# EAGLE board backplane (EAGLE 9.6.2), part 1 of 2
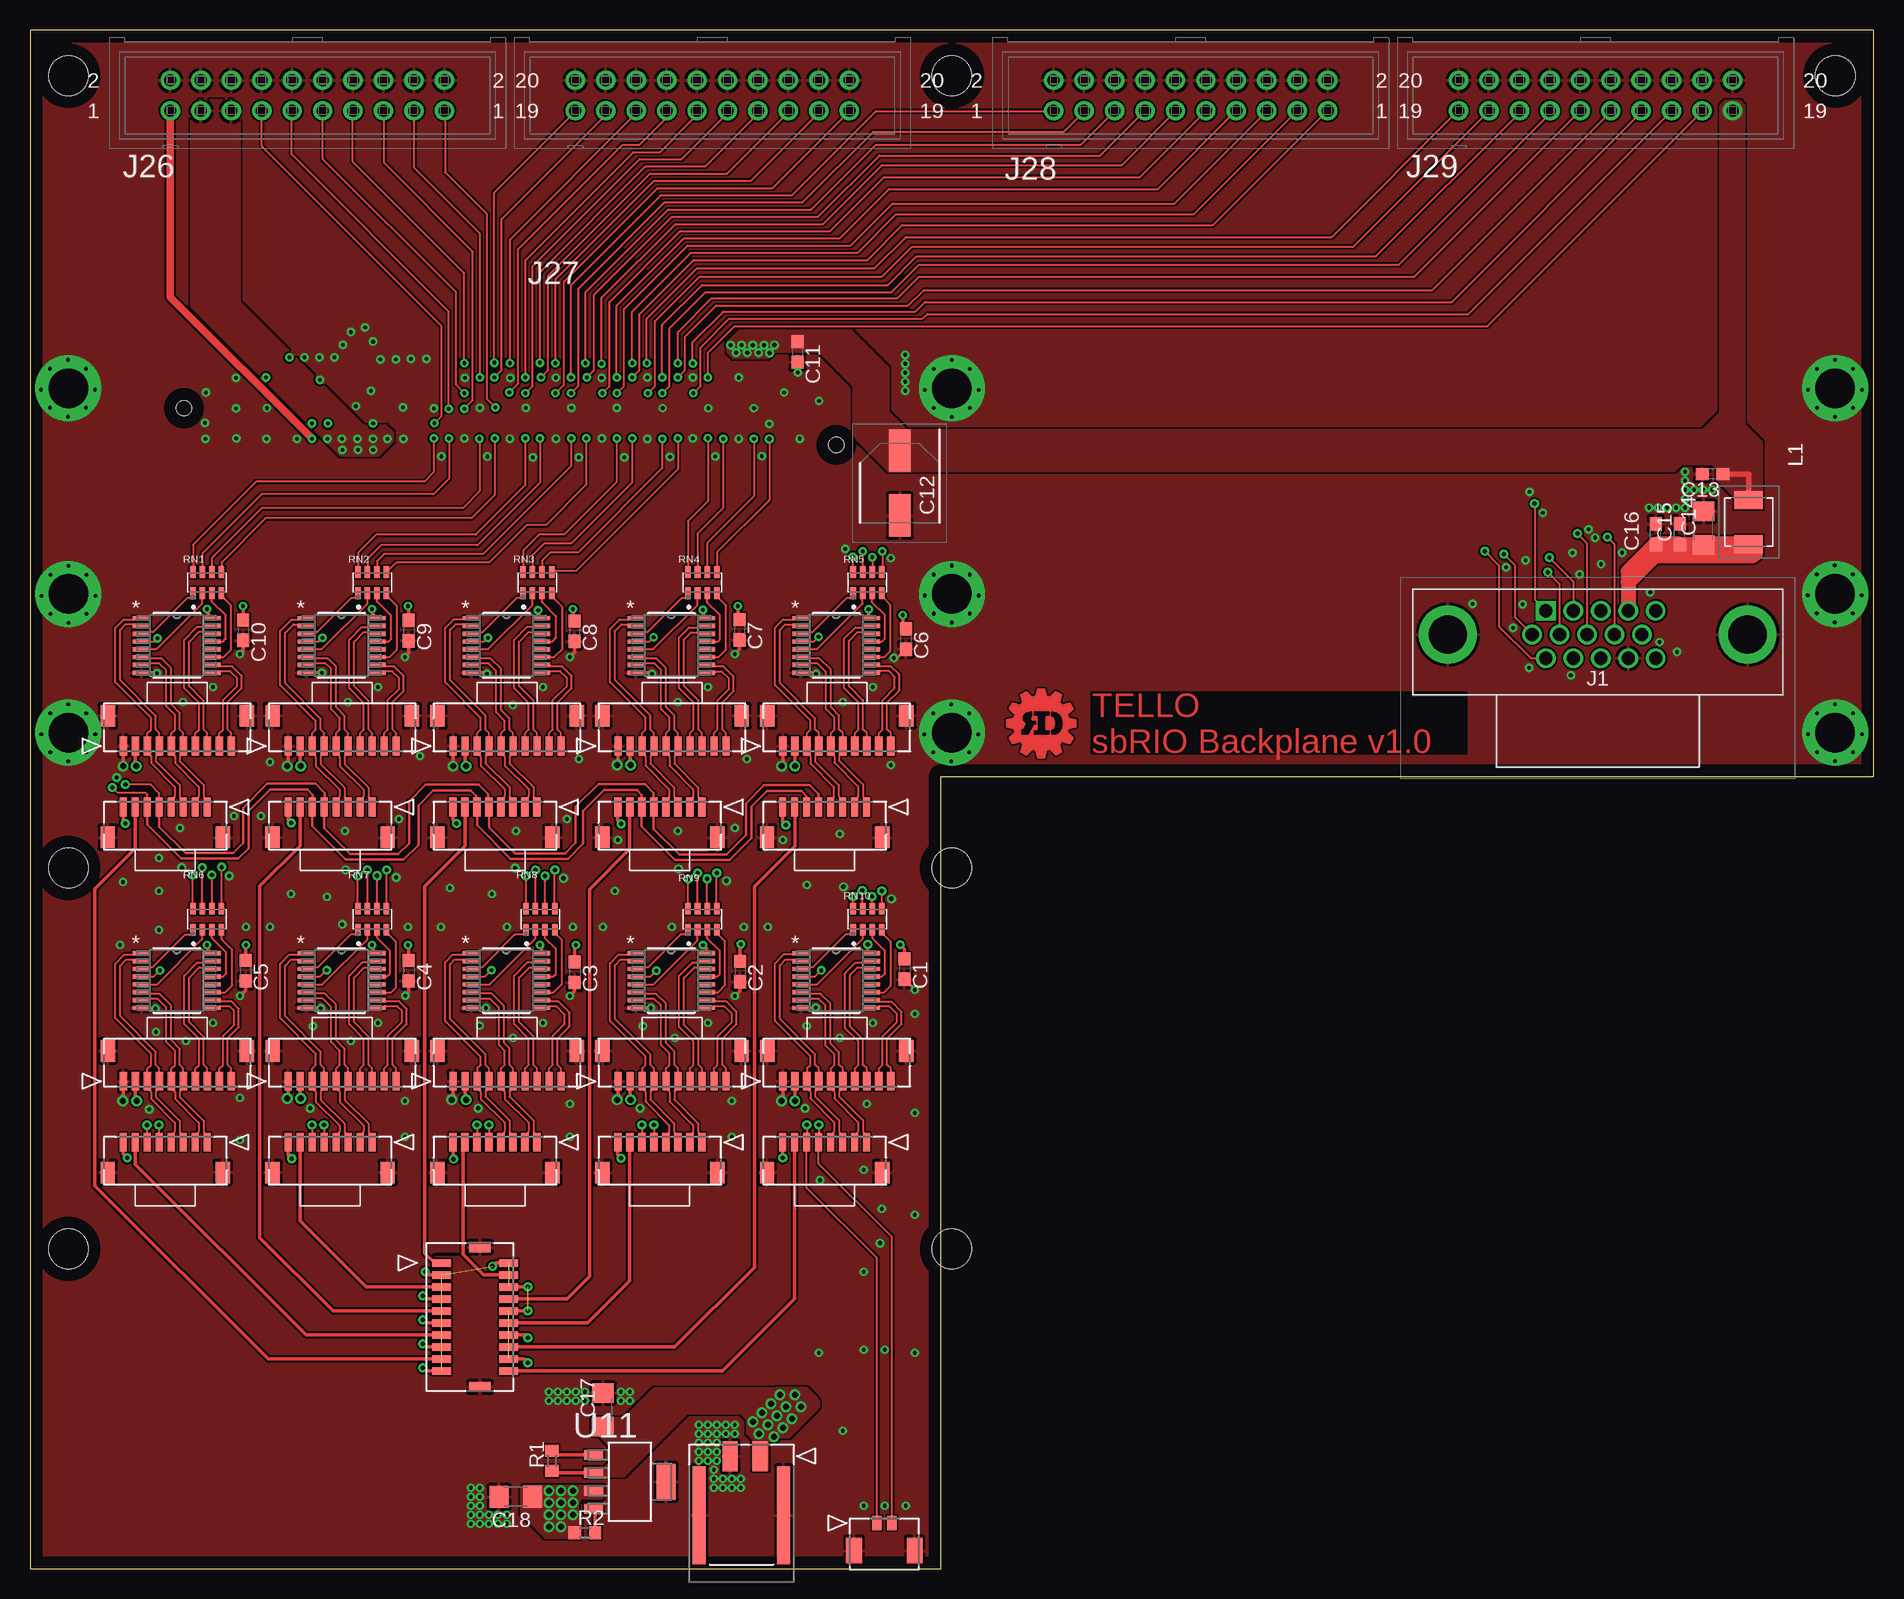
[diagram p5: board, top side]
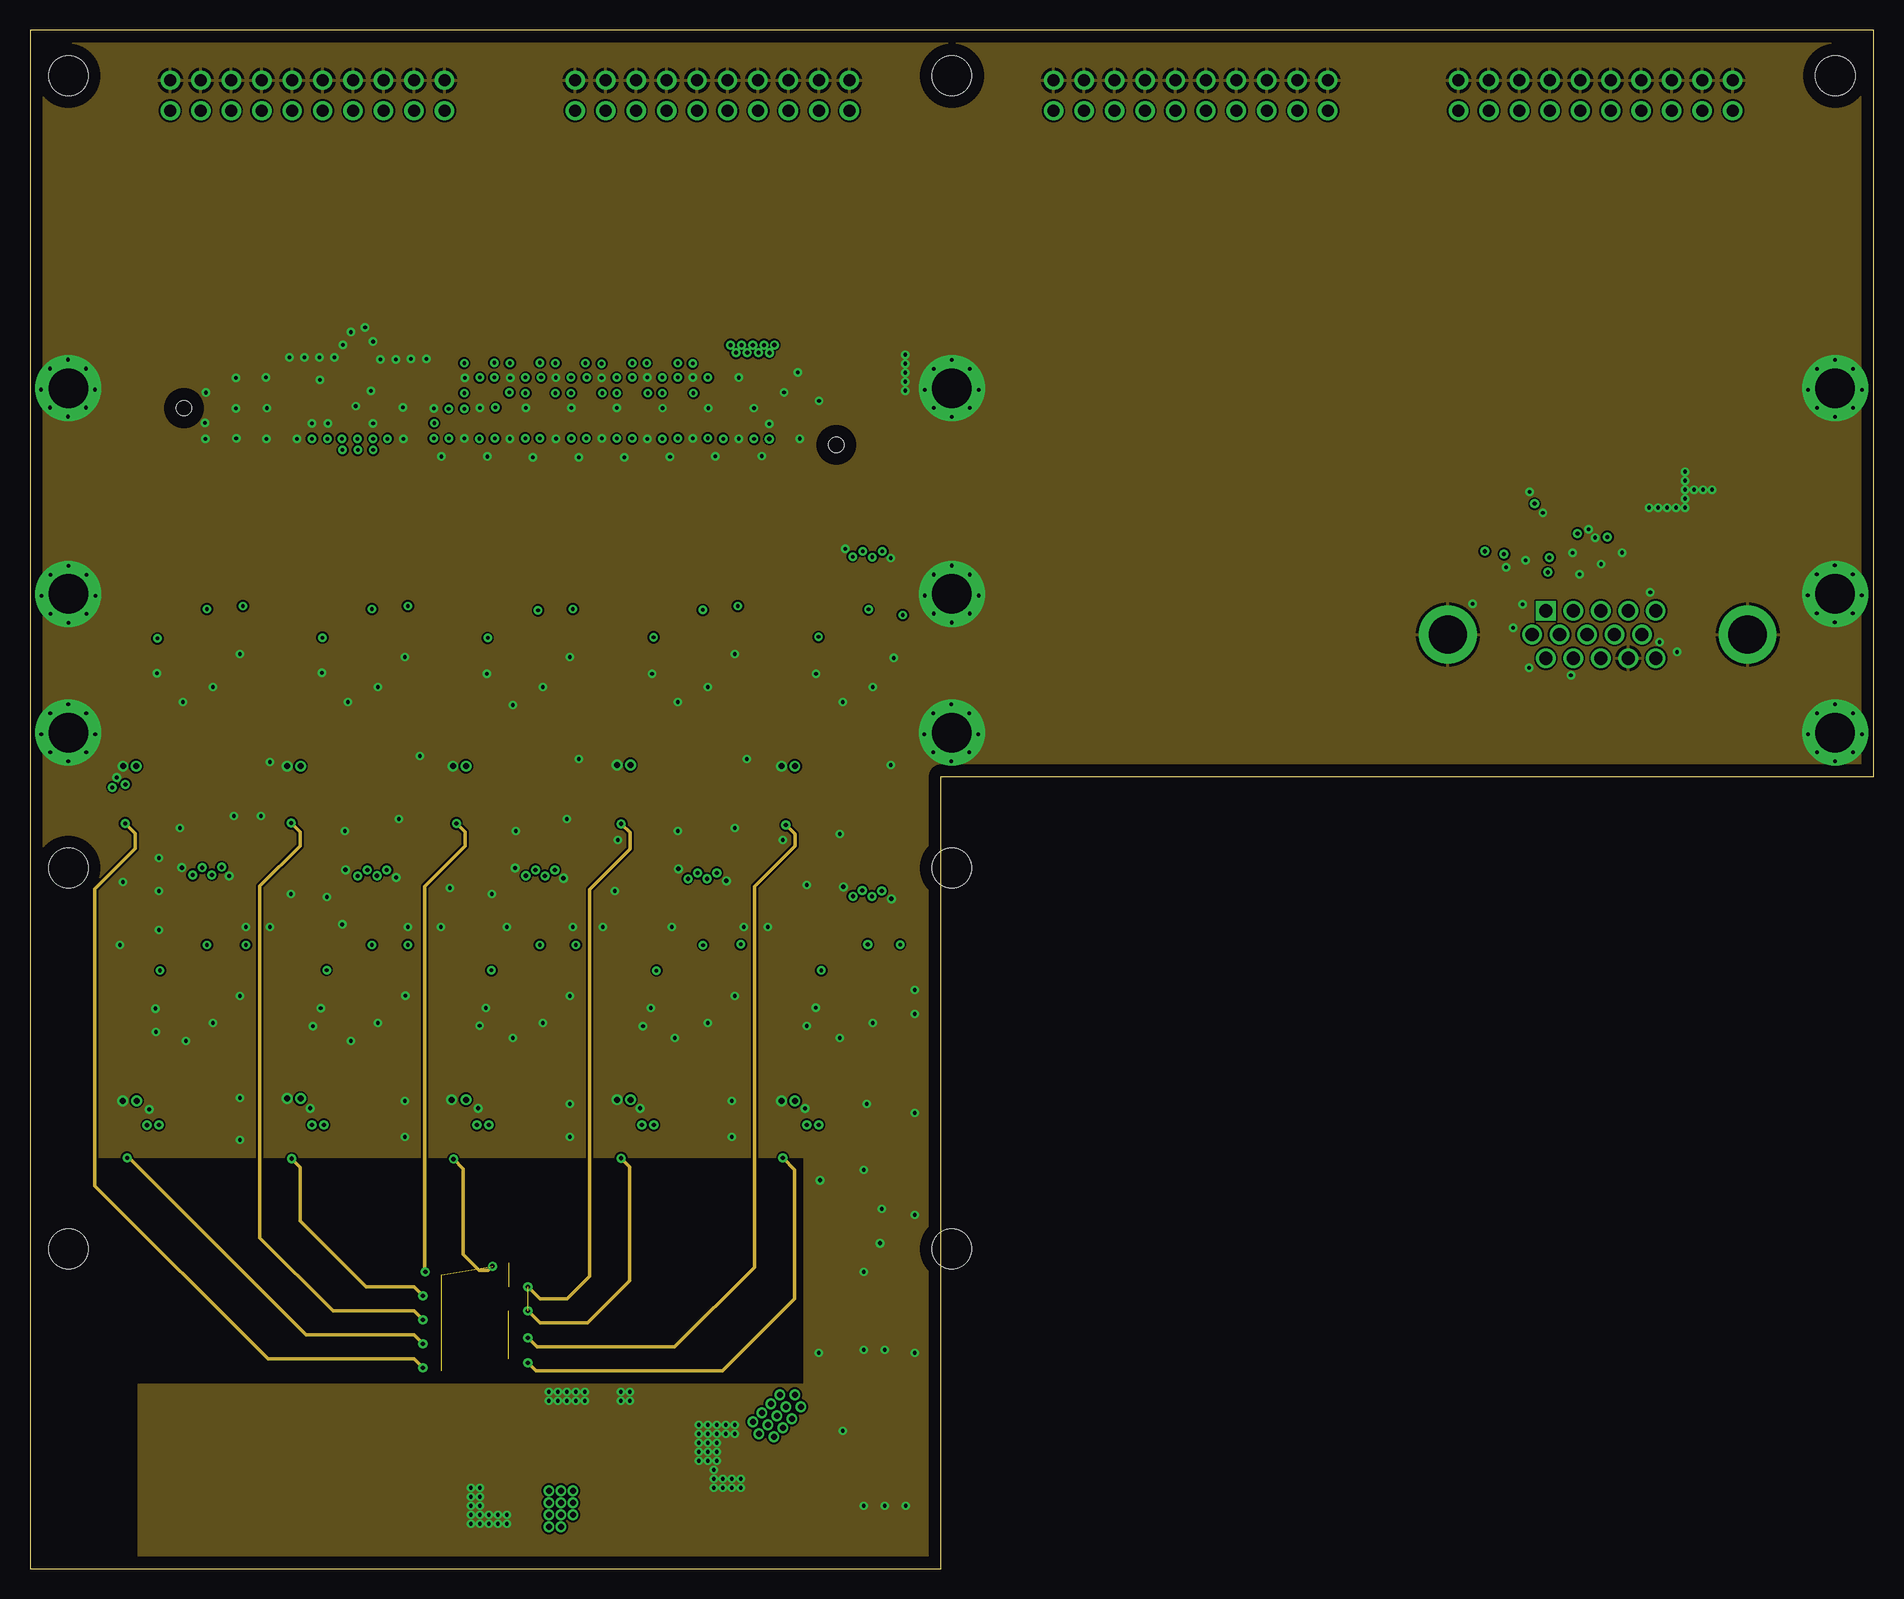
[diagram p6: board, inner layer Route2]
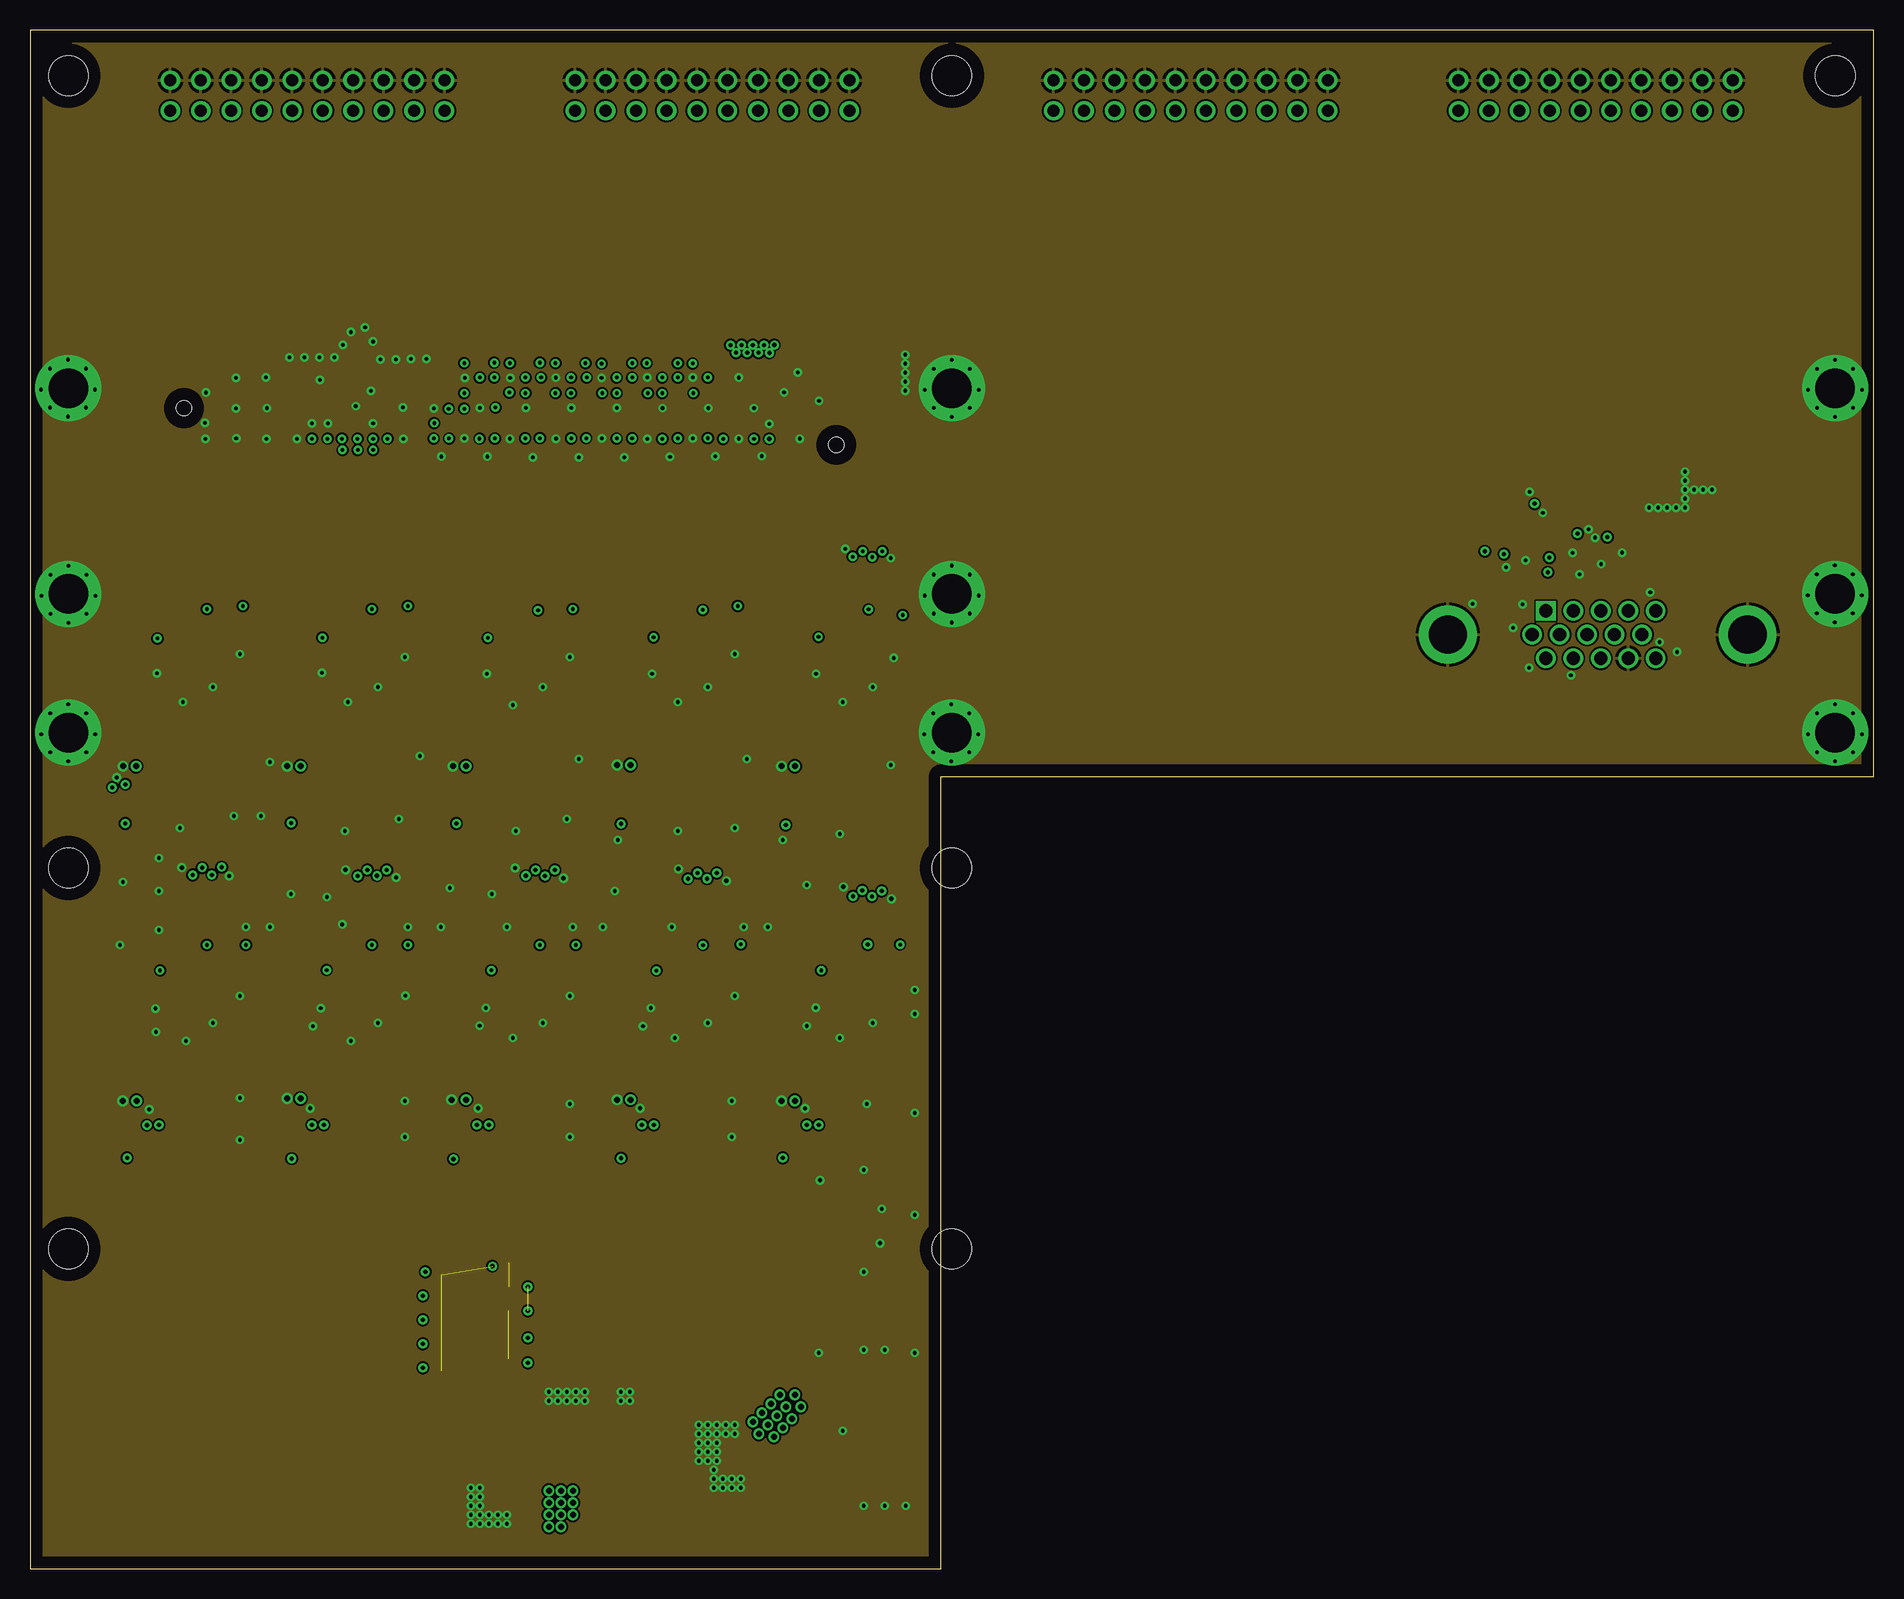
[diagram p7: board, inner layer Route15]
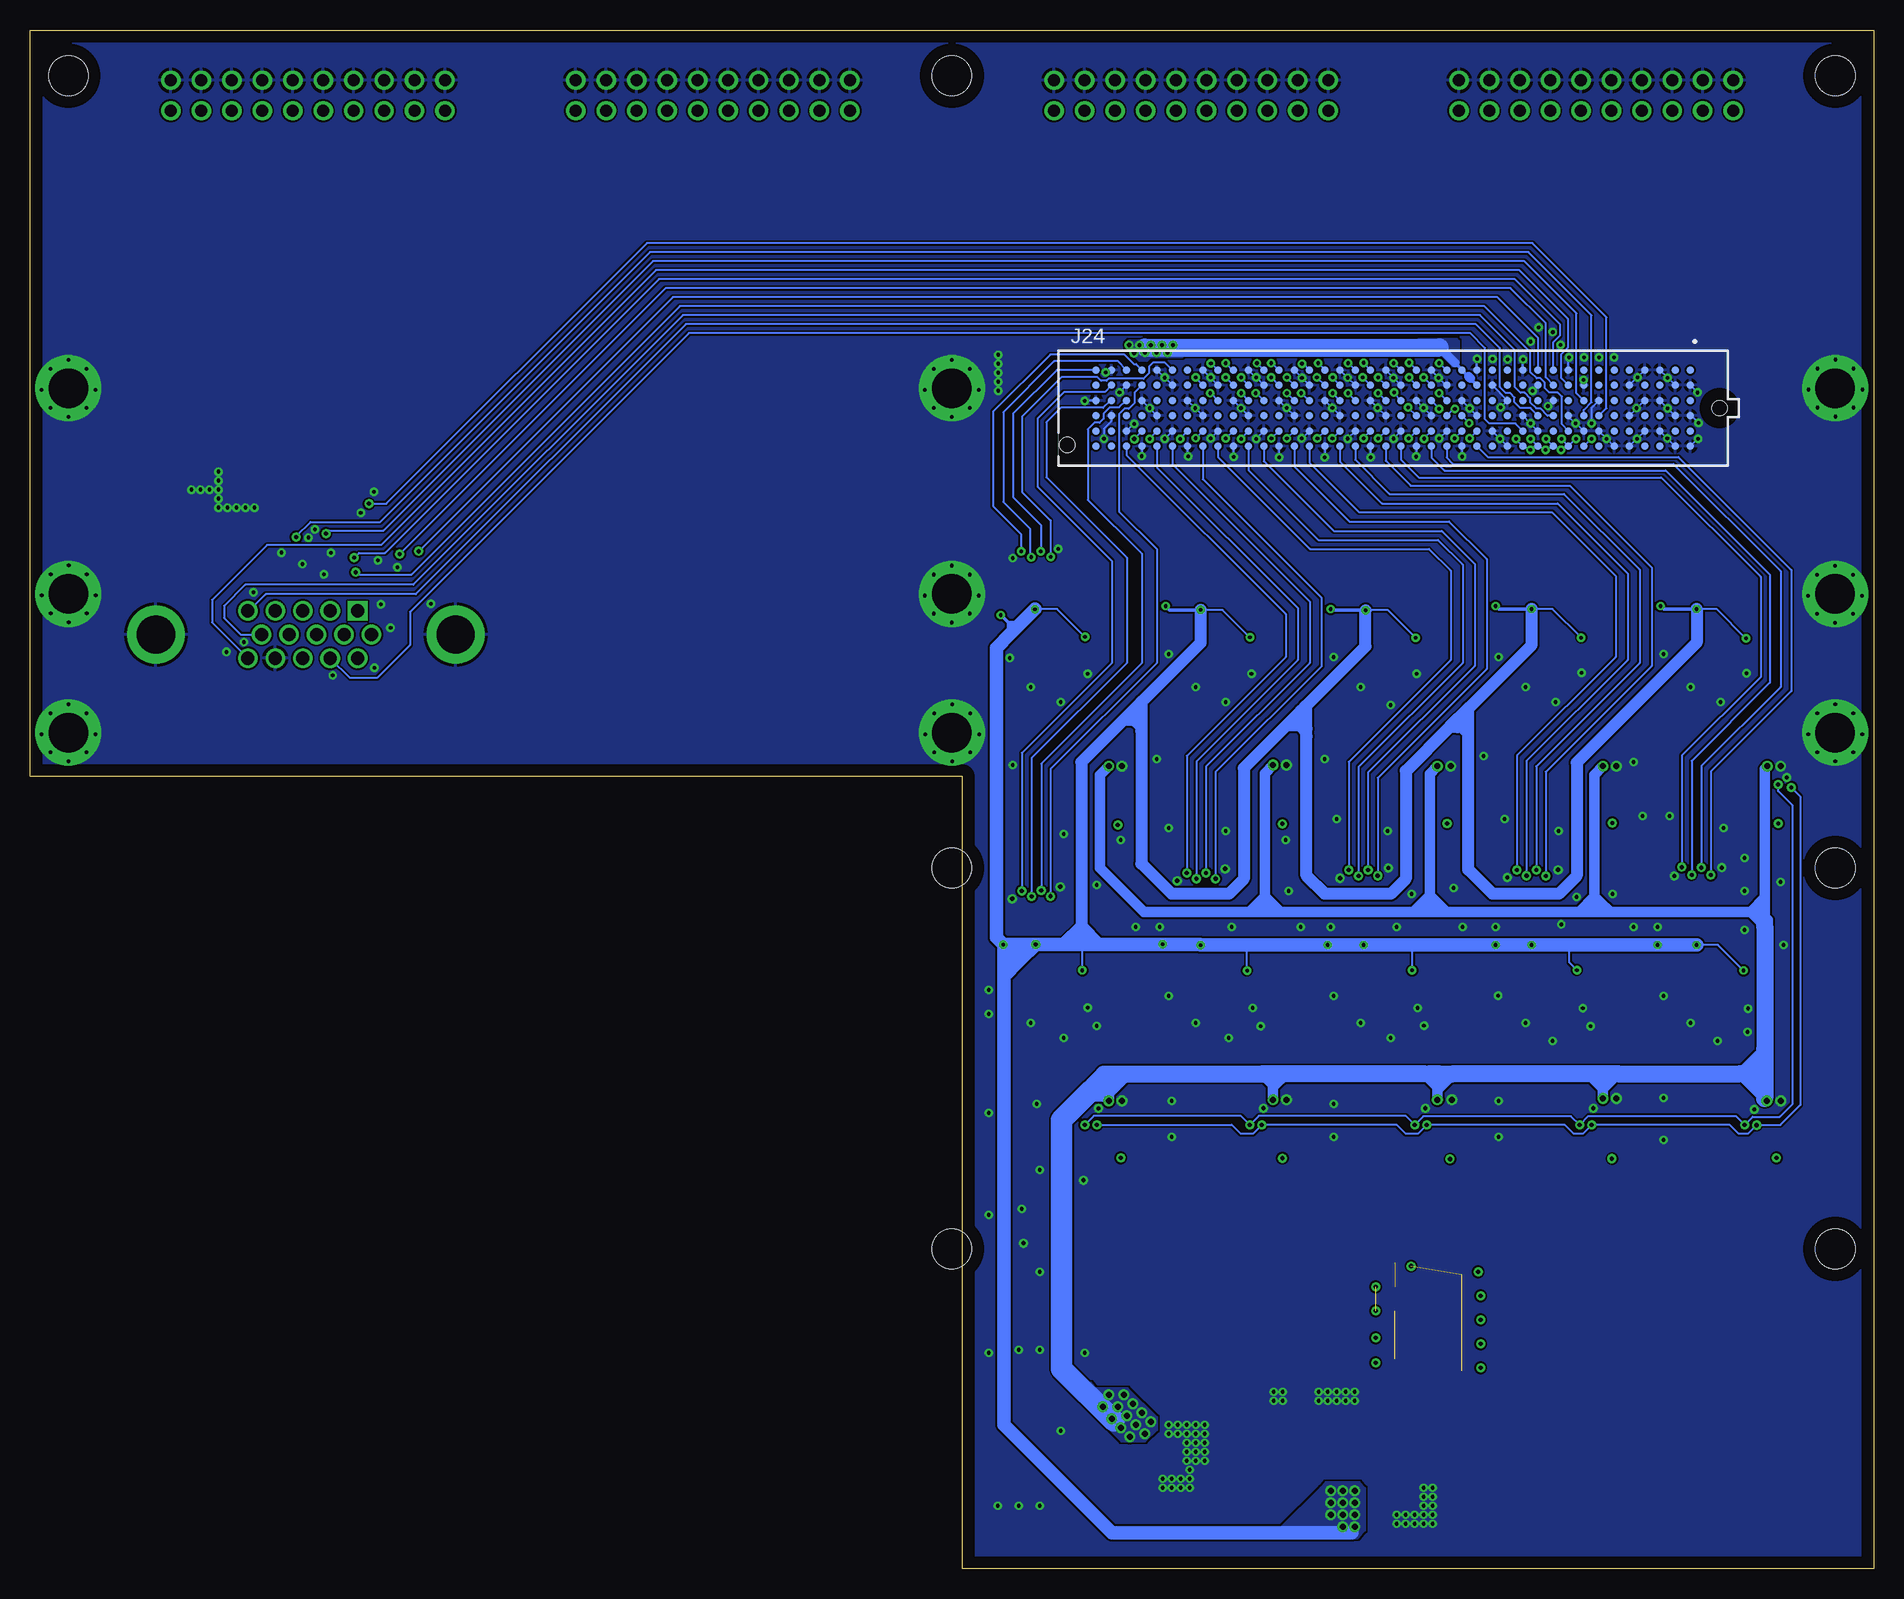
[diagram p8: board, bottom side, seen from below]

Size 153.67 x 128.27 mm. Coordinates in mm from the lower left corner, seen from the top.
Outline: 0,0 75.95,0 75.95,66.04 153.67,66.04 153.67,128.27 0,128.27 0,0
Copper layers (1+2*15+16): Top 0.035mm / dielectric 1.5mm / Route2 0.035mm / dielectric 0.15mm / Route15 0.035mm / dielectric 0.2mm / Bottom 0.035mm
Design rules "default *": minimum track width 6mil, minimum drill 0.3mm, track to track 6mil, track to pad 6mil, pad to pad 6mil, via to via 6mil, smd to smd 6mil, copper to edge 40mil, drill to drill 6mil, minimum pad ring 10mil, minimum via ring 8mil, stop-mask expansion 4mil, vias tented up to drill 25mil, thermal gap 10mil
Net classes: 1 RS422: width 0.152 mm, clearance 0.26 mm; 2 Analog: width 0.305 mm, clearance 0.305 mm
Holes 3.3 mm at 3.2,26.67 76.83,26.67 3.2,124.46 76.83,124.46 150.47,124.46 76.83,58.42 3.2,58.42
tRestrict: 1 lines

## Footprints (pad centres in the part's own frame; a part is rotated, then mirrored left to right if it is on the bottom)
C0603 = smd 1.1 x 1: 1 -0.85,0; 2 0.85,0
CAPAE660X580N = smd 3.55 x 1.8: 1 -2.7,0; 2 2.7,0
C1206 = smd 1.6 x 1.8: 1 -1.4,0; 2 1.4,0
L717HDE15PD4CH4R = drill 1.09 pad 1.635 square: 1 -16.825,1.98 | drill 1.09 pad 1.635: 2 -14.535,1.98; 3 -12.245,1.98; 4 -9.955,1.98; 5 -7.665,1.98; 6 -17.97,0; 7 -15.68,0; 8 -13.39,0; 9 -11.1,0; 10 -8.81,0; 11 -16.825,-1.98; 12 -14.535,-1.98; 13 -12.245,-1.98; 14 -9.955,-1.98; 15 -7.665,-1.98 | drill 3.2 pad 4.8: MH1 -24.99,0; MH2 0,0
CON_1054301102_MOL = smd 1.24 x 2.5: 1 0,0; 2 -2.5,0 | smd 1.1 x 8.2: 3 1.97,-4.93; 4 -5.07,-4.93
CON_5011902017 = smd 0.6 x 1.6: 1 0,0; 2 0,5.6; 3 1,0; 4 1,5.6; 5 2,0; 6 2,5.6; 7 3,0; 8 3,5.6; 9 4,0; 10 4,5.6; 11 5,0; 12 5,5.6; 13 6,0; 14 6,5.6; 15 7,0; 16 7,5.6; 17 8,0; 18 8,5.6; 19 9,0; 20 9,5.6 | smd 0.85 x 1.8: 21 -1.325,3.2; 22 10.325,3.2
CON_5013310807 = smd 0.6 x 1.55: 1 0,0; 2 -1,0; 3 -2,0; 4 -3,0; 5 -4,0; 6 -5,0; 7 -6,0; 8 -7,0 | smd 1.2 x 1.8: 9 1.3,-2.525; 10 -8.3,-2.525
CON_5013311007 = smd 0.6 x 1.55: 1 0,0; 2 -1,0; 3 -2,0; 4 -3,0; 5 -4,0; 6 -5,0; 7 -6,0; 8 -7,0; 9 -8,0; 10 -9,0 | smd 1.2 x 1.8: 11 1.3,-2.525; 12 -10.3,-2.525
SAMTEC_SEAM-40-03.0-S-06-2-A-K-TR = smd 0.64 x 0.64: A1 24.765,3.175; A2 23.495,3.175; A3 22.225,3.175; A4 20.955,3.175; A5 19.685,3.175; A6 18.415,3.175; A7 17.145,3.175; A8 15.875,3.175; A9 14.605,3.175; A10 13.335,3.175; A11 12.065,3.175; A12 10.795,3.175; A13 9.525,3.175; A14 8.255,3.175; A15 6.985,3.175; A16 5.715,3.175; A17 4.445,3.175; A18 3.175,3.175; A19 1.905,3.175; A20 0.635,3.175; A21 -0.635,3.175; A22 -1.905,3.175; A23 -3.175,3.175; A24 -4.445,3.175; A25 -5.715,3.175; A26 -6.985,3.175; A27 -8.255,3.175; A28 -9.525,3.175; A29 -10.795,3.175; A30 -12.065,3.175; A31 -13.335,3.175; A32 -14.605,3.175; A33 -15.875,3.175; A34 -17.145,3.175; A35 -18.415,3.175; A36 -19.685,3.175; A37 -20.955,3.175; A38 -22.225,3.175; A39 -23.495,3.175; A40 -24.765,3.175; B1 24.765,1.905; B2 23.495,1.905; B3 22.225,1.905; B4 20.955,1.905; B5 19.685,1.905; B6 18.415,1.905; B7 17.145,1.905; B8 15.875,1.905; B9 14.605,1.905; B10 13.335,1.905; B11 12.065,1.905; B12 10.795,1.905; B13 9.525,1.905; B14 8.255,1.905; B15 6.985,1.905; B16 5.715,1.905; B17 4.445,1.905; B18 3.175,1.905; B19 1.905,1.905; B20 0.635,1.905; B21 -0.635,1.905; B22 -1.905,1.905; B23 -3.175,1.905; B24 -4.445,1.905; B25 -5.715,1.905; B26 -6.985,1.905; B27 -8.255,1.905; B28 -9.525,1.905; B29 -10.795,1.905; B30 -12.065,1.905; B31 -13.335,1.905; B32 -14.605,1.905; B33 -15.875,1.905; B34 -17.145,1.905; B35 -18.415,1.905; B36 -19.685,1.905; B37 -20.955,1.905; B38 -22.225,1.905; B39 -23.495,1.905; B40 -24.765,1.905; C1 24.765,0.635; C2 23.495,0.635; C3 22.225,0.635; C4 20.955,0.635; C5 19.685,0.635; C6 18.415,0.635; C7 17.145,0.635; C8 15.875,0.635; C9 14.605,0.635; C10 13.335,0.635; C11 12.065,0.635; C12 10.795,0.635; C13 9.525,0.635; C14 8.255,0.635; C15 6.985,0.635; C16 5.715,0.635; C17 4.445,0.635; C18 3.175,0.635; C19 1.905,0.635; C20 0.635,0.635; C21 -0.635,0.635; C22 -1.905,0.635; C23 -3.175,0.635; C24 -4.445,0.635; C25 -5.715,0.635; C26 -6.985,0.635; C27 -8.255,0.635; C28 -9.525,0.635; C29 -10.795,0.635; C30 -12.065,0.635; C31 -13.335,0.635; C32 -14.605,0.635; C33 -15.875,0.635; C34 -17.145,0.635; C35 -18.415,0.635; C36 -19.685,0.635; C37 -20.955,0.635; C38 -22.225,0.635; C39 -23.495,0.635; C40 -24.765,0.635; D1 24.765,-0.635; D2 23.495,-0.635; D3 22.225,-0.635; D4 20.955,-0.635; D5 19.685,-0.635; D6 18.415,-0.635; D7 17.145,-0.635; D8 15.875,-0.635; D9 14.605,-0.635; D10 13.335,-0.635; D11 12.065,-0.635; D12 10.795,-0.635; D13 9.525,-0.635; D14 8.255,-0.635; D15 6.985,-0.635; D16 5.715,-0.635; D17 4.445,-0.635; D18 3.175,-0.635; D19 1.905,-0.635; D20 0.635,-0.635; D21 -0.635,-0.635; D22 -1.905,-0.635; D23 -3.175,-0.635; D24 -4.445,-0.635; D25 -5.715,-0.635; D26 -6.985,-0.635; D27 -8.255,-0.635; D28 -9.525,-0.635; D29 -10.795,-0.635; D30 -12.065,-0.635; D31 -13.335,-0.635; D32 -14.605,-0.635; D33 -15.875,-0.635; D34 -17.145,-0.635; D35 -18.415,-0.635; D36 -19.685,-0.635; D37 -20.955,-0.635; D38 -22.225,-0.635; D39 -23.495,-0.635; D40 -24.765,-0.635; E1 24.765,-1.905; E2 23.495,-1.905; E3 22.225,-1.905; E4 20.955,-1.905; E5 19.685,-1.905; E6 18.415,-1.905; E7 17.145,-1.905; E8 15.875,-1.905; E9 14.605,-1.905; E10 13.335,-1.905; E11 12.065,-1.905; E12 10.795,-1.905; E13 9.525,-1.905; E14 8.255,-1.905; E15 6.985,-1.905; E16 5.715,-1.905; E17 4.445,-1.905; E18 3.175,-1.905; E19 1.905,-1.905; E20 0.635,-1.905; E21 -0.635,-1.905; E22 -1.905,-1.905; E23 -3.175,-1.905; E24 -4.445,-1.905; E25 -5.715,-1.905; E26 -6.985,-1.905; E27 -8.255,-1.905; E28 -9.525,-1.905; E29 -10.795,-1.905; E30 -12.065,-1.905; E31 -13.335,-1.905; E32 -14.605,-1.905; E33 -15.875,-1.905; E34 -17.145,-1.905; E35 -18.415,-1.905; E36 -19.685,-1.905; E37 -20.955,-1.905; E38 -22.225,-1.905; E39 -23.495,-1.905; E40 -24.765,-1.905; F1 24.765,-3.175; F2 23.495,-3.175; F3 22.225,-3.175; F4 20.955,-3.175; F5 19.685,-3.175; F6 18.415,-3.175; F7 17.145,-3.175; F8 15.875,-3.175; F9 14.605,-3.175; F10 13.335,-3.175; F11 12.065,-3.175; F12 10.795,-3.175; F13 9.525,-3.175; F14 8.255,-3.175; F15 6.985,-3.175; F16 5.715,-3.175; F17 4.445,-3.175; F18 3.175,-3.175; F19 1.905,-3.175; F20 0.635,-3.175; F21 -0.635,-3.175; F22 -1.905,-3.175; F23 -3.175,-3.175; F24 -4.445,-3.175; F25 -5.715,-3.175; F26 -6.985,-3.175; F27 -8.255,-3.175; F28 -9.525,-3.175; F29 -10.795,-3.175; F30 -12.065,-3.175; F31 -13.335,-3.175; F32 -14.605,-3.175; F33 -15.875,-3.175; F34 -17.145,-3.175; F35 -18.415,-3.175; F36 -19.685,-3.175; F37 -20.955,-3.175; F38 -22.225,-3.175; F39 -23.495,-3.175; F40 -24.765,-3.175 | hole 1.27: -27.19,-3.05; 27.19,0
CON_5055670271 = smd 0.8 x 1.2: 1 0,0; 2 -1.25,0 | smd 1.3 x 2.15: 3 1.9,2.295; 4 -3.15,2.295
SAMTEC-TST-110-01-X-D = drill 1.02 pad 1.62: 1 -11.43,-1.46; 2 -11.43,1.08; 3 -8.89,-1.46; 4 -8.89,1.08; 5 -6.35,-1.46; 6 -6.35,1.08; 7 -3.81,-1.46; 8 -3.81,1.08; 9 -1.27,-1.46; 10 -1.27,1.08; 11 1.27,-1.46; 12 1.27,1.08; 13 3.81,-1.46; 14 3.81,1.08; 15 6.35,-1.46; 16 6.35,1.08; 17 8.89,-1.46; 18 8.89,1.08; 19 11.43,-1.46; 20 11.43,1.08
WE-LHMI_402048 = smd 1.5 x 2.4: 1 -1.85,0; 2 1.85,0
R0603 = smd 1 x 1.1: 1 -0.85,0; 2 0.85,0
RESCAV80P320X160X70-8N = smd 0.53 x 0.97: 1 -1.2,-0.875; 2 -0.4,-0.875; 3 0.4,-0.875; 4 1.2,-0.875; 5 1.2,0.875; 6 0.4,0.875; 7 -0.4,0.875; 8 -1.2,0.875
PW16 = smd 1.462 x 0.355: 1 -2.921,2.275; 2 -2.921,1.625; 3 -2.921,0.975; 4 -2.921,0.325; 5 -2.921,-0.325; 6 -2.921,-0.975; 7 -2.921,-1.625; 8 -2.921,-2.275; 9 2.921,-2.275; 10 2.921,-1.625; 11 2.921,-0.975; 12 2.921,-0.325; 13 2.921,0.325; 14 2.921,0.975; 15 2.921,1.625; 16 2.921,2.275
SOT150P696X180-5N = smd 1.6 x 0.838: 1 -3.023,2.261; 2 -3.023,0.762; 3 -3.023,-0.762; 4 -3.023,-2.261 | smd 1.6 x 2.997: 5 3.023,0

## Placement (x,y rotation side)
C1  0.1uF  [C0603]  72.91,49.99 270 top
C2  0.1uF  [C0603]  59.19,49.78 270 top
C3  0.1uF  [C0603]  45.41,49.73 270 top
C4  0.1uF  [C0603]  31.58,49.85 270 top
C5  0.1uF  [C0603]  17.96,49.85 270 top
C6  0.1uF  [C0603]  73,77.5 270 top
C7  0.1uF  [C0603]  59.15,78.28 270 top
C8  0.1uF  [C0603]  45.38,78.16 270 top
C9  0.1uF  [C0603]  31.57,78.21 270 top
C10  0.1uF  [C0603]  17.77,78.25 270 top
C11  4.7uF  [C0603]  63.97,101.44 270 top
C12  875105144010  [CAPAE660X580N]  72.5,90.5 270 top
C13  0.1uF  [C0603]  140.25,91.25 180 top
C14  100uF  [C1206]  139.5,86.75 90 top
C15  0.1uF  [C0603]  137.5,86.25 90 top
C16  0.01uF  [C0603]  135.5,86.25 90 top
C17  68uF  [C1206]  47.75,13.25 90 top
C18  33uF  [C1206]  40.5,6 180 top
J1  L717HDE15PD4CH4R  [L717HDE15PD4CH4R]  143.18,77.88 0 top
J2  1054301102  [CON_1054301102_MOL]  60.85,9.39 0 top
J3  5011902017  [CON_5011902017]  34.3,25.48 270 top
J4  5013310807  [CON_5013310807]  14.78,63.5 0 top
J5  5013310807  [CON_5013310807]  28.52,63.5 0 top
J6  5013310807  [CON_5013310807]  42.26,63.5 0 top
J7  5013310807  [CON_5013310807]  55.99,63.5 0 top
J8  5013310807  [CON_5013310807]  69.73,63.5 0 top
J9  5013310807  [CON_5013310807]  14.78,35.56 0 top
J10  5013310807  [CON_5013310807]  28.52,35.56 0 top
J11  5013310807  [CON_5013310807]  42.26,35.56 0 top
J12  5013310807  [CON_5013310807]  55.99,35.56 0 top
J13  5013310807  [CON_5013310807]  69.73,35.56 0 top
J14  5013311007  [CON_5013311007]  7.79,68.58 180 top
J15  5013311007  [CON_5013311007]  21.53,68.58 180 top
J16  5013311007  [CON_5013311007]  35.27,68.58 180 top
J17  5013311007  [CON_5013311007]  49.01,68.58 180 top
J18  5013311007  [CON_5013311007]  62.75,68.58 180 top
J19  5013311007  [CON_5013311007]  7.79,40.64 180 top
J20  5013311007  [CON_5013311007]  21.53,40.64 180 top
J21  5013311007  [CON_5013311007]  35.27,40.64 180 top
J22  5013311007  [CON_5013311007]  49.01,40.64 180 top
J23  5013311007  [CON_5013311007]  62.75,40.64 180 top
J24  SEAM-40-03.0-S-06-2-A-K-TR  [SAMTEC_SEAM-40-03.0-S-06-2-A-K-TR]  40.03,96.75 0 bottom
J25  5055670271  [CON_5055670271]  70.59,3.81 180 top
J26  SAMTEC-TST-110-01-X-DJ  [SAMTEC-TST-110-01-X-D]  23.12,123 0 top
J27  SAMTEC-TST-110-01-X-DJ  [SAMTEC-TST-110-01-X-D]  56.88,123 0 top
J28  SAMTEC-TST-110-01-X-DJ  [SAMTEC-TST-110-01-X-D]  96.75,123 0 top
J29  SAMTEC-TST-110-01-X-DJ  [SAMTEC-TST-110-01-X-D]  130.5,123 0 top
L1  74437324068  [WE-LHMI_402048]  143.25,87.25 270 top
R1  10K  [R0603]  43.5,9 90 top
R2  10K  [R0603]  46.25,3 0 top
RN1  742C083470JP  [RESCAV80P320X160X70-8N]  14.77,82.2 0 top
RN2  742C083470JP  [RESCAV80P320X160X70-8N]  28.52,82.2 0 top
RN3  742C083470JP  [RESCAV80P320X160X70-8N]  42.28,82.2 0 top
RN4  742C083470JP  [RESCAV80P320X160X70-8N]  56.05,82.2 0 top
RN5  742C083470JP  [RESCAV80P320X160X70-8N]  69.81,82.2 0 top
RN6  742C083470JP  [RESCAV80P320X160X70-8N]  14.77,54.14 0 top
RN7  742C083470JP  [RESCAV80P320X160X70-8N]  28.52,54.14 0 top
RN8  742C083470JP  [RESCAV80P320X160X70-8N]  42.53,54.14 0 top
RN9  742C083470JP  [RESCAV80P320X160X70-8N]  56.05,54.14 0 top
RN10  742C083470JP  [RESCAV80P320X160X70-8N]  69.81,54.14 0 top
U1  AM26LV32EIPWR  [PW16]  12.23,76.97 0 top
U2  AM26LV32EIPWR  [PW16]  25.98,76.97 0 top
U3  AM26LV32EIPWR  [PW16]  39.72,76.97 0 top
U4  AM26LV32EIPWR  [PW16]  53.45,76.97 0 top
U5  AM26LV32EIPWR  [PW16]  67.19,76.97 0 top
U6  AM26LV32EIPWR  [PW16]  12.23,49.03 0 top
U7  AM26LV32EIPWR  [PW16]  25.98,49.03 0 top
U8  AM26LV32EIPWR  [PW16]  39.72,49.03 0 top
U9  AM26LV32EIPWR  [PW16]  53.45,49.03 0 top
U10  AM26LV32EIPWR  [PW16]  67.19,49.03 0 top
U11  LP3962EMP-3.3  [SOT150P696X180-5N]  50,7.25 0 top

## Tracks (layer width: path | path; a pad name or v marks a point on that pad's centre or on a via)
3V3  (via drill 0.3, 0.35, 0.5)
  Top 0.152: U1.4 10.38,77.3 v10.63,77.55 | U2.4 24.05,77.3 v24.37,77.61 | U3.4 37.86,77.3 v38.16,77.59 | U4.4 51.63,77.3 v51.98,77.64 | U5.4 65.34,77.3 v65.73,77.68 | U6.4 10.32,49.35 v10.84,49.88 | U7.4 24.18,49.35 v24.73,49.9 | U8.4 37.93,49.35 v38.46,49.88 | U9.4 51.72,49.35 v52.22,49.86 | U10.4 65.43,49.35 v65.95,49.88
  Top 0.305: U10.16 69.91,51.3 69.82,51.4 69.82,52.03 v69.83,52.05 | U6.16 14.75,51.71 v14.75,52 | U7.16 28.5,51.7 v28.5,52 | U8.16 42.64,51.86 v42.5,52 | U9.16 56.38,51.71 v56.1,51.98 | U1.16 14.75,79.65 v14.75,80 | U2.16 28.5,79.64 v28.5,80 | U3.16 42.35,79.53 v42.35,79.9 | U4.16 56.09,79.54 v56.09,79.93 | v69.9,79.97 v69.89,79.96 69.89,79.47 U5.16 | C6.1 72.75,78.6 v72.75,79.5 | C7.1 59,79.28 v59,80.25 | C8.1 45.25,79.14 v45.25,80 | C9.1 31.57,80.17 v31.5,80.25 | C10.1 17.75,79.11 v17.75,80.25 | C4.1 31.58,51.92 v31.5,52 | C5.1 17.96,51.96 v18,52 | C3.1 45.41,51.91 v45.5,52 | C2.1 59.19,51.98 v59.25,52.05 | C1.1 72.91,51.65 v72.53,52.03
  Bottom 0.152: v10.63,77.55 13.08,80 v14.75,80 | v24.37,77.61 26.76,80 v28.5,80 | v38.16,77.59 40.47,79.9 v42.35,79.9 | v51.98,77.64 54.27,79.93 v56.09,79.93 | v65.73,77.68 68.05,80 69.89,80 | v10.84,49.88 12.96,52 v14.75,52 | v24.73,49.9 25.37,50.54 25.37,52 | v38.46,49.88 38.46,51.83 38.63,52 | v52.22,49.86 52.22,51.81 52.41,52 | v65.95,49.88 65.95,52 65.91,52.05
  Bottom 0.305: v28.5,52 26.7,52 | v42.5,52 40.7,52 | v56.1,51.98 54.17,51.98 53.83,52.34 | v69.83,52.05 67.97,52.05 67.55,52.47 | 69.59,80.25 69.86,79.97 v69.89,79.97 v69.9,79.97 69.89,79.98 69.89,80 | v72.75,79.5 72.12,78.88 | 72.12,78.88 71.57,78.32 | 72.12,78.88 72.12,78.12 71.94,77.94 | 72.12,78.88 71.01,78.88 70.94,78.94 | v59,80.25 58.68,79.93 v56.09,79.93 | v45.25,80 45.15,79.9 v42.35,79.9 | v31.5,80.25 31.25,80 v28.5,80 | v17.75,80.25 17.5,80 v14.75,80
  Bottom 0.508: 34.66,70.16 33.77,69.28 33.77,69.25 | 48.16,70.3 47.26,69.39 | 61.66,70.75 61.66,70.45 61.03,69.83
  Bottom 1.016: v28.5,80 28.5,77 33.75,71.75 | v14.75,80 14.75,77.2 24.75,67.2 24.75,57.75 26.25,56.25 31.75,56.25 33.77,58.27 33.77,69.25 33.77,70 | 33.77,70 33.77,71.72 33.75,71.75 | 33.75,71.75 33.75,71.77 35.36,70.16 | 35.36,70.16 39,66.52 39,57.5 40.25,56.25 45.75,56.25 47.26,57.76 47.26,69.39 47.26,70 | v42.35,79.9 42.35,76.88 47.73,71.5 | 47.26,70 47.26,71.98 47.73,71.5 | v56.09,79.93 56.09,77.2 61.03,72.25 | 47.73,71.5 48.94,70.3 | 48.94,70.3 52.5,66.73 52.5,57.5 53.75,56.25 58.5,56.25 61.03,58.78 61.03,69.83 61.03,70.75 | 61.03,72.25 61.03,70.75 | 66.04,53.57 66.04,67.25 62.52,70.77 | 66.04,53.57 66.04,53.55 | 66.04,53.55 66.04,52.07 65.25,52.07 65.25,52.05 | 61.03,72.25 62.52,70.77 | 33.77,70 33.93,70.16 34.66,70.16 35.36,70.16 | 47.26,70 47.55,70.3 48.16,70.3 48.94,70.3 | 61.03,70.75 61.66,70.75 62.5,70.75 62.52,70.77 | 66.04,53.57 64.52,52.05 64.5,52.05 | 66.04,53.55 67.51,52.09 67.51,52.05
  Bottom 1.143: v14.75,52 v18,52 25.37,52 v28.5,52 v31.5,52 38.63,52 v42.5,52 v45.5,52 52.41,52 56.09,52 v56.1,51.98 56.16,52.05 v59.25,52.05 64.5,52.05 65.25,52.05 65.91,52.05 67.51,52.05 v69.83,52.05 | v69.83,52.05 71.19,50.69 | 71.19,50.69 72.5,49.38 | 43.5,3 63.5,3 72.5,12 72.5,49.38 | 71.19,50.69 72.5,52 | 72.5,52 v72.53,52.03 | v72.53,52.03 73.12,52.62 73.12,76.77 71.94,77.94 71.57,78.32 70.94,78.94 69.89,80 | 72.5,49.38 72.5,52 | v72.53,52.03 69.86,52.03 v69.83,52.05
  other vias: 43.25,3.5 44.25,3.5 43.25,4.5 44.25,4.5 45.25,4.5 45.25,5.5 44.25,5.5 43.25,5.5 43.25,6.5 44.25,6.5 45.25,6.5
  pour Top (no thermals): 47.78,6.93 41.19,6.93 40.93,6.67 40.93,4.6 42.95,2.58 45.81,2.58 45.92,2.69 45.92,4.05 45.67,4.29 45.67,5.52 46.03,5.88 47.7,5.88 47.78,5.97
  pour Bottom (no thermals): 44.51,2.55 43.04,2.55 42.73,2.85 42.38,3.21 42.38,6.71 42.87,7.19 43.04,7.19 45.66,7.19 46.08,6.76 49.39,3.46 51.08,3.46 51.19,3.34 51.19,2.6 51.12,2.53 51.05,2.53 45.19,2.53
3V3_SBRIO  (via drill 0.3)
  Top 0.152: J26.1 11.7,121.22
  Top 0.635: v23.5,94.2 11.7,106 11.7,121.22
  Bottom 0.152: J24.F8 23.53,94.2 v23.5,94.2
5V  (via drill 0.5)
  Top 0.305: J19.2 8.79,39.1 v8.88,39.01 | J20.2 22.53,39.22 v22.55,39.2 | J21.2 36.27,39.18 v36.35,39.1 | J22.2 50.01,39.14 v50.05,39.1 | J23.2 v63.75,39 | J18.2 v63.75,66.9 | J17.2 50.01,67.04 v50.05,67 | J16.2 36.27,66.98 v36.35,66.9 | J15.2 22.53,66.92 v22.55,66.9 | J14.2 8.79,66.96 v8.85,66.9 | U11.2 43.64,8.01 R1.1
  Bottom 0.508: 9.07,54.75 9.07,54.59 8.63,54.15 8.63,53.55
  Bottom 0.889: 21.3,41.25 22.56,39.99 v22.56,39.21 v22.55,39.2 22.55,40.04 22.93,40.42 | 22.93,40.42 23.76,41.25 | 36.35,40.16 v36.35,39.1 36.35,39.91 35.01,41.25 35.02,41.26 34.79,41.26 34.79,41.24 | 36.35,40.16 37.22,41.03 | 37.22,41.03 37.45,41.26 37.08,41.26 37.08,41.25 | 48.95,41.26 50.05,40.15 v50.05,39.1 50.05,40.34 50.8,41.09 | 50.8,41.09 50.95,41.23 49.76,41.23 49.73,41.26 49.74,41.26 49.76,41.24 | 63.75,39.6 v63.75,39 64.11,39.36 | 63.75,39.6 63.75,40.11 64.94,40.11 64.98,40.11 65.22,39.88 64.63,39.88 64.11,39.36 | 62.12,41.23 63.3,40.05 | 63.3,40.05 63.75,39.6 | 10.81,41.56 11.13,41.25 v8.88,39.01 9.07,39.19 | 9.07,43.31 9.94,42.44 | v8.85,66.9 9.07,66.67 9.07,55.95 | 9.07,55.95 9.07,54.75 | 9.07,54.75 9.07,53.58 10.25,54.75 | 22.25,41.25 22.25,41.1 22.93,40.42 | 36.25,41.26 36.25,40.26 36.35,40.16 | 23.27,56.05 23.27,66.19 v22.55,66.9 | v36.35,66.9 36.98,66.27 36.98,56.15 | 50.91,41.26 50.83,41.17 | 50.74,56.05 52.03,54.75 | 50.74,56.05 50.74,66.31 v50.05,67 | 63.3,40.05 63.3,40.83 64.17,40.83 | 64.17,40.83 64.17,41.23 | v63.75,66.9 64.47,66.19 64.47,58.41 60.81,54.75 52.03,54.75 | 64.23,40.83 64.17,40.83 | 50.8,41.2 50.8,41.09 | 36.99,41.26 37.22,41.03 | 9.94,42.44 9.94,40.69 | 9.94,40.69 9.75,40.5 | 9.94,40.69 10.81,41.56 | 10.81,41.56 9.94,42.44 | 64.11,39.36 64.44,39.36 64.44,39.37 65.25,39.37 65.56,39.06 | 9.07,54.75 10.25,54.75 | 10.25,54.75 21.96,54.75 | 21.96,54.75 22.86,55.65 | 22.86,55.65 23.27,56.05 | 21.96,54.75 23.32,54.75 | 23.32,54.75 24.54,54.75 | 24.54,54.75 35.6,54.75 | 36.98,56.13 35.6,54.75 | 35.6,54.75 37.01,54.75 | 37.01,54.75 38.38,54.75 | 38.38,54.75 49.44,54.75 | 50.74,56.05 50.34,55.66 | 50.34,55.66 49.44,54.75
  Bottom 0.889: 49.44,54.75 50.84,54.75 | 50.84,54.75 52.03,54.75 | 10.25,54.75 10.25,54.77 9.07,55.95 | 23.27,56.05 23.27,56.02 24.54,54.75 | 22.86,55.65 23.32,55.17 23.32,54.75 | 36.98,56.15 38.38,54.75 | 36.98,56.15 36.98,56.13 | 36.98,56.13 36.98,54.77 37.01,54.75 | 50.34,55.66 50.84,55.16 50.84,54.75
  Bottom 1.397: 11.13,41.25 21.3,41.25 22.25,41.25 23.76,41.25 35.01,41.25 | 37.45,41.26 48.95,41.26 49.73,41.26 | 50.95,41.23 62.12,41.23 64.17,41.23 | 9.07,53.58 9.07,43.31 9.07,39.19 | 35.02,41.26 36.25,41.26 36.99,41.26 | 49.74,41.26 50.91,41.26
  Bottom 1.778: 65.22,39.88 67.67,37.42 67.67,16.68 63.31,12.33 | 64.94,40.11 64.23,40.83
  other vias: 62.5,14.5 61.75,13.75 61,13 60.25,12.25 60.75,11.25 61.5,12 62,11 62.25,12.75 62.75,11.75 63,13.5 63.75,14.5 64.25,13.5 63.5,12.5
  pour Top (no thermals): 60.25,8.25 60.25,10.75 59.75,11.25 59.75,12.6 62.22,15.06 64.69,15.06 65.75,14 65.75,13.5 63.21,10.96 61.71,10.96 61.5,10.75 61.5,8.25
  pour Bottom (no thermals): 65.25,15.5 64.81,15.06 62.2,15.06 59.75,12.61 59.75,11.6 60.73,10.62 62.7,10.62 66.62,14.55 65.67,15.5
  pour Top (no thermals): 47,12.5 49.5,12.5 51.25,14.25 52,15 62.5,15 64.75,15 65.5,14.25 65.5,13.25 63.25,11 61.25,11 59.75,12.5 59.25,13 57.5,13 54.75,13 53.75,12 49.5,7.75 46.25,7.75 46.25,8.36 47.88,8.36 48.35,8.82 48.35,10.24 48.14,10.46 47.42,11.18 46.97,11.18 46.9,11.25 46.9,12.49
5V_C_SERIES  (via drill 0.35)
  Top 0.457: C13.1 143.25,91.25 L1.1
  Bottom 0.305: J24.B15 33.59,99.22 33.61,99.22 J24.A16 34.31,99.94 34.87,100.5
  Bottom 0.762: 34.87,100.5 36.16,101.8 | 33.59,99.22 33.76,99.38
  Bottom 1.5: 60.74,101.8 36.16,101.8
  other vias: 58.39,101.99 59.31,102 60.25,102 61.18,102 60.73,101.37 58.85,101.38 59.78,101.38 62.05,102.02 61.63,101.36
  pour Bottom (no thermals): 56.68,102.36 62.12,102.36 62.35,102.12 62.35,101.83 61.23,100.72 60.51,100.72 60.24,100.98 57.62,100.98 56.85,101.75 56.62,101.75 56.62,102.3
  pour Bottom: 37.9,102.48 34.73,102.48 34.59,102.34 34.59,100.44 34.79,100.23 35.09,100.23 36.02,101.16 37.83,101.16 37.92,101.25 37.92,102.47
  pour Top (no thermals): 143.4,94.9 73.1,94.9 71.6,96.4 71.6,100.1 68.48,103.22 59.12,103.22 58.1,102.2 58.1,101.4 58.6,100.9 61.5,100.9 62.05,101.45 65.75,101.45 68.6,98.6 68.6,94.4 71.5,91.5 137.1,91.5 137.7,92.1 140.2,92.1 140.6,91.7 140.6,90.8 142.1,89.3 142.1,88.4 144.4,88.4 144.4,93.9
  pour Top (no thermals): 139.4,94.9 140.9,96.4 140.9,121.2 140.9,122 141.3,122.4 142.5,122.4 142.7,122.2 142.9,122 142.9,120.8 142.9,95.4 143.9,94.4 143.3,93.8 142.4,93.8 140.5,93.8
5V_FILT
  Top 1.27: L1.2 139.55,85.4 C14.1 137.55,85.35 C15.1 C16.1 133.22,83.12 133.22,82.25 | 133.22,82.25 J1.4 | 133.22,82.25 135.42,84.44 143.59,84.44 143.81,84.67
5V_SBRIO  (via drill 0.3)
  Bottom 0.152: J24.F9 26,94.15 v26,94.2 | J24.F10 27.3,94.18 v27.3,94.2 | J24.F11 v28.59,94.2 v28.6,94.2 | v29.8,94.2 29.8,94.14 J24.F12 29.11,93.58 28.8,93.26 v28.61,93.26 28.5,93.26 28.19,93.58 J24.F11 | J24.F9 | J24.F9 v24.8,94.2 | J24.F9 25.6,93.58 25.91,93.26 v26.05,93.26 26.2,93.26 26.52,93.58 J24.F10 | J24.F10 26.84,93.58 27.15,93.26 v27.32,93.26 27.5,93.26 27.81,93.58 J24.F11
  pour Top: 13.4,105.25 25.85,92.8 29.1,92.8 30.3,94 30.3,94.7 29.7,95.3 27.8,95.3 17.5,105.6 17.5,122.4 13.4,122.4
A_M1
  Top 0.152: U10.11 71.19,48.05 71.76,48.62 71.76,52.24 71,52.99 RN10.4
A_M1_N
  Top 0.152: J23.9 70.75,41.72 71.04,42.01 71.04,44.38 72.25,45.58 72.25,46.25 71.63,46.87 70.78,46.87 70.66,46.76 U10.9
A_M1_P
  Top 0.152: J23.10 71.75,41.72 71.46,42.01 71.46,44.21 72.66,45.41 72.66,46.42 71.8,47.28 70.72,47.28 70.6,47.41 U10.10
A_M2
  Top 0.152: U5.11 71.23,76 71.72,76.49 71.72,80.35 71,81.07 RN5.4
A_M2_N
  Top 0.152: J18.9 70.75,69.66 71.04,69.95 71.04,72.38 72.08,73.42 72.08,74.33 71.6,74.81 70.7,74.81 70.58,74.69 U5.9
A_M2_P
  Top 0.152: J18.10 71.75,69.66 71.46,69.95 71.46,72.21 72.38,73.12 | 72.38,73.12 | 72.38,73.12 72.5,73.25 72.5,74.5 72.38,74.62 | 72.38,74.62 | 72.38,74.62 71.77,75.23 70.7,75.23 70.58,75.34 U5.10
A_M3
  Top 0.152: U9.11 57.34,48.05 57.95,48.66 57.95,52.3 57.24,53.01 RN9.4
A_M3_N
  Top 0.152: J22.9 57.01,41.72 57.3,42.01 57.3,44.39 58.5,45.58 58.5,46.25 57.88,46.87 56.96,46.87 56.84,46.76 U9.9
A_M3_P
  Top 0.152: J22.10 58.01,41.72 57.72,42.01 57.72,44.22 58.91,45.41 58.91,46.42 58.05,47.28 56.96,47.28 56.84,47.41 U9.10
A_M4
  Top 0.152: U4.11 57.4,76 58.03,76.63 58.03,80.3 57.24,81.08 RN4.4
A_M4_N
  Top 0.152: J17.9 57.01,69.66 57.3,69.95 57.3,72.39 58.25,73.33 58.25,74.22 57.66,74.81 56.99,74.81 56.88,74.69 U4.9
A_M4_P
  Top 0.152: J17.10 58.01,69.66 57.72,69.95 57.72,72.22 58.66,73.16 58.66,74.39 57.83,75.22 56.98,75.22 56.86,75.34 U4.10
A_M5
  Top 0.152: U8.11 43.62,48.05 44.34,48.77 44.34,52.4 43.73,53.01 RN8.4
A_M5_N
  Top 0.152: J21.9 43.27,41.72 43.56,42.01 43.56,44.4 44.58,45.42 44.58,46.17 43.88,46.87 43.25,46.87 43.13,46.76 U8.9
A_M5_P
  Top 0.152: J21.10 44.27,41.72 43.98,42.01 43.98,44.23 44.88,45.12 | 44.88,45.12 | 44.88,45.12 45,45.25 45,46.34 44.88,46.46 | 44.88,46.46 | 44.88,46.46 44.05,47.28 43.25,47.28 43.13,47.41 U8.10
A_M6
  Top 0.152: U3.11 43.7,76 44.38,76.67 44.38,80.17 43.48,81.06 RN3.4
A_M6_N
  Top 0.152: J16.9 43.27,69.66 43.56,69.95 43.56,72.4 44.75,73.58 44.75,74.25 44.19,74.81 43.25,74.81 43.13,74.69 U3.9
A_M6_P
  Top 0.152: J16.10 44.27,69.66 43.98,69.95 43.98,72.23 45.16,73.41 45.16,74.42 44.36,75.22 43.25,75.22 43.13,75.34 U3.10
A_M7
  Top 0.152: U7.11 30.11,48.05 30.5,48.45 30.5,52.27 29.73,53.05 RN7.4
A_M7_N
  Top 0.152: J20.9 29.53,41.72 29.82,42.01 29.82,44.41 31,45.58 31,46.5 30.62,46.88 29.5,46.88 29.38,46.76 U7.9
A_M7_P
  Top 0.152: J20.10 30.53,41.72 30.24,42.01 30.24,44.24 31.41,45.41 31.41,46.67 30.79,47.29 29.5,47.29 29.39,47.41 U7.10
A_M8
  Top 0.152: U2.11 29.96,76 30.59,76.63 30.59,80.25 29.73,81.11 RN2.4
A_M8_N
  Top 0.152: J15.9 29.53,69.66 29.82,69.95 29.82,72.41 30.75,73.33 30.75,74.25 30.2,74.8 29.5,74.8 29.4,74.69 U2.9
A_M8_P
  Top 0.152: J15.10 30.53,69.66 30.24,69.95 30.24,72.24 31.16,73.16 31.16,74.42 30.37,75.21 29.53,75.21 29.4,75.34 U2.10
A_M9
  Top 0.152: U6.11 16.27,48.05 16.86,48.63 16.86,51.59 15.96,52.48 RN6.4
A_M9_N
  Top 0.152: J19.9 15.79,41.72 16.08,42.01 16.08,44.42 17,45.33 17,46.5 16.62,46.88 15.78,46.88 15.65,46.76 U6.9
A_M9_P
  Top 0.152: J19.10 16.79,41.72 16.5,42.01 16.5,44.25 17.41,45.16 17.41,46.67 16.8,47.29 15.78,47.29 15.66,47.41 U6.10
A_M10
  Top 0.152: U1.11 16.13,76 16.77,76.63 16.77,80.28 15.96,81.08 RN1.4
A_M10_N
  Top 0.152: J14.9 15.79,69.66 16.08,69.95 16.08,72.42 17.25,73.58 17.25,74.25 16.7,74.8 15.76,74.8 15.65,74.69 U1.9
A_M10_P
  Top 0.152: J14.10 16.79,69.66 16.5,69.95 16.5,72.25 17.66,73.41 17.66,74.42 16.87,75.21 15.76,75.21 15.62,75.34 U1.10
AGND  (via drill 0.35)  (9 unrouted)
  Top 0.305: J3.18 41.18,17.48 v41.5,17.16 | v62.75,34.25 62.73,34.27 J13.8 | J3.14 41.27,19.48 v41.5,19.25 | v63,62 62.73,62.27 J8.8 | J3.10 41.48,21.48 v41.5,21.5 | v49.28,34.23 48.99,34.51 J12.8 | J3.6 41.48,23.48 v41.5,23.5 | v49.27,62.1 48.99,62.37 J7.8 | J3.2 38.8,25.48 v38.55,25.22 | v35.3,34.15 35.26,34.2 J11.8 | J3.3 33.23,24.48 v32.95,24.75 | v35.55,62.12 35.26,62.41 J6.8 | J3.7 33.02,22.48 v32.75,22.75 | v21.8,34.19 21.52,34.48 J10.8 | J3.11 33.02,20.48 v32.75,20.75 | v21.78,62.16 21.52,62.43 J5.8 | J3.15 33.02,18.48 v32.75,18.75 | v8.09,34.25 7.78,34.57 J9.8 | J3.19 33.02,16.48 v32.75,16.75 | v7.95,62.12 7.95,62.17 7.78,62.35 J4.8
  Route2 0.305: v41.5,17.16 42.18,16.48 57.73,16.48 63.73,22.48 63.73,33.27 v62.75,34.25 | v41.5,19.25 42.27,18.48 53.73,18.48 60.38,25.14 60.38,56.88 63.75,60.25 63.75,61.25 v63,62 | v41.5,21.5 42.52,20.48 46.48,20.48 49.99,24 49.99,33.51 v49.28,34.23 | v41.5,23.5 42.5,22.5 44.75,22.5 46.63,24.39 46.63,56.63 50,60 50,61.37 v49.27,62.1 | v35.3,34.15 36.1,33.34 36.1,26.2 37.44,24.86 38.18,24.86 v38.55,25.22 | v32.95,24.75 32.9,24.82 32.9,56.9 36.25,60.25 36.25,61.41 v35.55,62.12 | v32.75,22.75 32.02,23.48 28.02,23.48 22.52,28.98 22.52,33.48 v21.8,34.19 | v32.75,20.75 32.02,21.48 25.27,21.48 19.16,27.59 19.16,56.91 22.52,60.27 22.52,61.43 v21.78,62.16 | v32.75,18.75 32.02,19.48 23.02,19.48 8.25,34.25 v8.09,34.25 | v32.75,16.75 32.02,17.48 19.86,17.48 5.4,31.93 5.4,56.65 8.78,60.02 8.78,61.29 v7.95,62.12
ANA1
  Top 0.305: J3.20 57.73,16.48 63.73,22.48 J13.7
ANA2
  Top 0.305: J3.16 53.73,18.48 60.38,25.14 60.38,56.88 63.75,60.25 63.75,63.48 J8.7
ANA3
  Top 0.305: J3.12 46.48,20.48 49.99,24 J12.7
ANA4
  Top 0.305: J3.8 39.92,22.5 44.75,22.5 46.63,24.39 46.63,56.63 49.99,59.99 J7.7
ANA5
  Top 0.305: J3.4 37.82,24.48 36.1,26.2 36.1,35.54 36.12,35.56 J11.7
ANA6
  Top 0.305: J3.1 33.71,25.48 32.9,26.3 32.9,56.9 36.26,60.26 J6.7
ANA7
  Top 0.305: J3.5 28.02,23.48 22.52,28.98 J10.7
ANA8
  Top 0.305: J3.9 25.27,21.48 19.16,27.59 19.16,56.91 22.52,60.27 J5.7
ANA9
  Top 0.305: J3.13 23.02,19.48 8.78,33.73 J9.7
ANA10
  Top 0.305: J3.17 19.86,17.48 5.4,31.93 5.4,56.65 8.78,60.02 J4.7
B_M1
  Top 0.152: U10.13 71.02,49.35 71.28,49.62 71.28,51.52 70.24,52.55 70.24,53.23 RN10.3
B_M1_N
  Top 0.152: J23.7 68.75,41.72 69.04,42.01 69.04,43.96 67.95,45.05 67.95,49.66 68.81,50.52 69.48,50.52 69.62,50.66 U10.15
B_M1_P
  Top 0.152: J23.8 69.75,41.72 69.46,42.01 69.46,44.13 68.36,45.22 68.36,49.48 68.98,50.11 69.51,50.11 69.62,50.01 U10.14
B_M2
  Top 0.152: U5.13 71.03,77.3 71.27,77.54 71.27,79.49 70.2,80.56 RN5.3
B_M2_N
  Top 0.152: J18.7 68.75,69.66 69.04,69.95 69.04,72.21 67.84,73.41 67.84,77.52 68.79,78.48 69.5,78.48 69.62,78.59 U5.15
B_M2_P
  Top 0.152: J18.8 69.75,69.66 69.46,69.95 69.46,72.38 68.25,73.58 68.25,77.35 68.97,78.06 69.5,78.06 69.62,77.94 U5.14
B_M3
  Top 0.152: U9.13 57.3,49.35 57.52,49.58 57.52,51.48 56.45,52.55 RN9.3
B_M3_N
  Top 0.152: J22.7 55.01,41.72 55.3,42.01 55.3,43.95 54.09,45.16 54.09,49.42 55.21,50.54 55.76,50.54 55.88,50.66 U9.15
B_M3_P
  Top 0.152: J22.8 56.01,41.72 55.72,42.01 55.72,44.12 54.5,45.33 54.5,49.25 55.38,50.13 55.78,50.13 55.91,50.01 U9.14
B_M4
  Top 0.152: U4.13 57.34,77.3 57.51,77.47 57.51,79.48 56.45,80.55 RN4.3
B_M4_N
  Top 0.152: J17.7 55.01,69.66 55.3,69.95 55.3,72.2 54.09,73.41 54.09,77.64 54.92,78.47 55.75,78.47 55.88,78.59 U4.15
B_M4_P
  Top 0.152: J17.8 56.01,69.66 55.72,69.95 55.72,72.37 54.5,73.58 54.5,77.47 55.09,78.06 55.77,78.06 55.88,77.94 U4.14
B_M5
  Top 0.152: U8.13 43.6,49.35 43.84,49.59 43.84,51.65 42.94,52.56 RN8.3
B_M5_N
  Top 0.152: J21.7 41.27,41.72 41.56,42.01 41.56,44.19 40.34,45.41 40.34,49.42 41.45,50.54 42.02,50.54 42.14,50.66 U8.15
B_M5_P
  Top 0.152: J21.8 42.27,41.72 41.98,42.01 41.98,44.36 40.75,45.58 40.75,49.25 41.62,50.12 42.06,50.12 42.19,50.01 U8.14
B_M6
  Top 0.152: U3.13 43.55,77.3 43.87,77.61 43.87,79.39 42.69,80.58 RN3.3
B_M6_N
  Top 0.152: J16.7 41.27,69.66 41.56,69.95 41.56,72.19 40.34,73.41 40.34,77.42 41.4,78.48 42.02,78.48 42.14,78.59 U3.15
B_M6_P
  Top 0.152: J16.8 42.27,69.66 41.98,69.95 41.98,72.36 40.75,73.58 40.75,77.25 41.57,78.07 41.99,78.07 42.12,77.94 U3.14
B_M7
  Top 0.152: U7.13 29.73,49.35 30.02,49.65 30.02,51.49 28.93,52.59 RN7.3
B_M7_N
  Top 0.152: J20.7 27.53,41.72 27.82,42.01 27.82,44.18 26.59,45.41 26.59,49.42 27.7,50.53 28.27,50.53 28.4,50.66 U7.15
B_M7_P
  Top 0.152: J20.8 28.53,41.72 28.24,42.01 28.24,44.35 27,45.58 27,49.25 27.87,50.12 28.32,50.12 28.44,50.01 U7.14
B_M8
  Top 0.152: U2.13 29.89,77.3 30.11,77.5 30.11,79.44 28.93,80.62 RN2.3
B_M8_N
  Top 0.152: J15.7 27.53,69.66 27.82,69.95 27.82,72.18 26.59,73.41 26.59,77.42 27.65,78.48 28.28,78.48 28.4,78.59 U2.15
B_M8_P
  Top 0.152: J15.8 28.53,69.66 28.24,69.95 28.24,72.35 27,73.58 27,77.25 27.82,78.07 28.27,78.07 28.4,77.94 U2.14
B_M9
  Top 0.152: U6.13 16.11,49.35 16.36,49.6 16.36,51.4 15.16,52.59 RN6.3
B_M9_N
  Top 0.152: J19.7 13.79,41.72 14.08,42.01 14.08,44.17 12.84,45.41 12.84,49.43 13.94,50.54 14.54,50.54 14.66,50.66 U6.15
B_M9_P
  Top 0.152: J19.8 14.79,41.72 14.5,42.01 14.5,44.34 13.25,45.58 13.25,49.26 14.12,50.12 14.54,50.12 14.66,50.01 U6.14
B_M10
  Top 0.152: U1.13 16.09,77.3 16.32,77.53 16.32,79.49 15.16,80.64 RN1.3
B_M10_N
  Top 0.152: J14.7 13.79,69.66 14.08,69.95 14.08,72.17 12.84,73.41 12.84,77.42 13.91,78.49 14.55,78.49 14.66,78.59 U1.15
B_M10_P
  Top 0.152: J14.8 14.79,69.66 14.5,69.95 14.5,72.34 13.25,73.58 13.25,77.25 14.08,78.08 14.52,78.08 14.66,77.94 U1.14
CVRT#_DIO3[1]  (via drill 0.35)
  Top 0.152: v131.47,86 132.07,85.41 J1.9
  Bottom 0.152: J24.D8 24.16,96.59 23.5,97.25 23.5,104.49 28.77,109.75 102,109.75 124.48,87.27 130.28,87.27 131.47,86.08 v131.47,86
DIO0  (via drill 0.35)
  Top 0.152: RN9.5 v57.24,57.99 v57.25,58
  Bottom 0.152: J24.F38 62.26,92.82 49,79.56 49,76 57.25,67.75 v57.25,58
DIO1  (via drill 0.35)
  Top 0.152: RN9.6 v56.45,57.52 v56.44,57.52
  Bottom 0.152: J24.F36 59.72,91.81 48,80.09 48,75.75 56.44,67.31 v56.44,57.52
DIO2  (via drill 0.35)
  Top 0.152: RN9.7 v55.65,57.99 v55.64,58
  Bottom 0.152: J24.F35 58.45,92.07 47,80.62 47,75.5 55.64,66.86 v55.64,58
DIO3  (via drill 0.35)
  Top 0.152: RN9.8 v54.84,57.51
  Bottom 0.152: J24.F33 55.91,90.83 46,80.92 46,75.25 54.84,66.41 v54.84,57.51
DIO4  (via drill 0.35)
  Top 0.152: RN8.5 43.73,58.23 v43.75,58.25
  Bottom 0.152: J24.F32 54.63,92.67 46.98,85.02 37.06,85.02 35.25,83.2 35.25,75.75 43.75,67.25 v43.75,58.25
DIO5  (via drill 0.35)
  Top 0.152: RN8.6 42.94,57.74 v42.92,57.75
  Bottom 0.152: J24.F30 52.09,91.58 46.27,85.75 36.3,85.75 34.25,83.7 34.25,75.5 42.92,66.83 v42.92,57.75
DIO6  (via drill 0.35)
  Top 0.152: RN8.7 v42.13,58.25 v42.13,58.26
  Bottom 0.152: J24.F29 50.83,92.33 45,86.5 36,86.5 33.25,83.75 33.25,75.25 42.13,66.37 v42.13,58.26
DIO7  (via drill 0.35)
  Top 0.152: RN8.8 v41.34,57.77 v41.33,57.77
  Bottom 0.152: J24.F27 48.28,91.89 43.7,87.3 35.4,87.3 32.25,84.16 32.25,75 41.33,65.92 v41.33,57.77
DIO8  (via drill 0.35)
  Top 0.152: RN7.5 v29.73,58.26
  Bottom 0.152: J24.F26 47.02,92.19 42.9,88.08 26.82,88.08 21.5,82.75 21.5,76 29.73,67.78 v29.73,58.26
DIO9  (via drill 0.35)
  Top 0.152: RN7.6 v28.93,57.77 | v28.93,57.77
  Bottom 0.152: J24.F24 44.48,92.3 40.98,88.81 26.33,88.81 20.5,82.97 20.5,75.75 28.93,67.33 v28.93,57.77
DIO10  (via drill 0.35)
  Top 0.152: RN7.7 v28.12,58.24 v28.12,58.25
  Bottom 0.152: J24.F23 43.2,92.45 40.34,89.59 25.8,89.59 19.5,83.29 19.5,75.5 28.12,66.88 v28.12,58.25
DIO11  (via drill 0.35)
  Top 0.152: RN7.8 v27.32,57.76
  Bottom 0.152: J24.F21 40.66,92.37 38.57,90.28 25.31,90.28 18.5,83.47 18.5,75.25 27.32,66.43 v27.32,57.76
DIO12  (via drill 0.35)
  Top 0.152: RN6.5 v15.96,58.48 v15.97,58.48
  Bottom 0.152: J24.F20 39.4,92.47 37.91,90.97 17.7,90.97 9.42,82.69 9.42,74.33 15.97,67.78 v15.97,58.48
DIO13  (via drill 0.35)
  Top 0.152: v15.16,57.84 RN6.6
  Bottom 0.152: J24.F18 36.85,92.64 35.77,91.56 17.33,91.56 8.63,82.86 8.63,73.86 15.16,67.34 v15.16,57.84
DIO14  (via drill 0.35)
  Top 0.152: RN6.7 14.37,58.42 v14.35,58.44
  Bottom 0.152: J24.F17 35.59,92.64 35.05,92.1 16.69,92.1 7.75,83.16 7.75,73.5 14.35,66.9 v14.35,58.44
DIO15  (via drill 0.35)
  Top 0.152: RN6.8 v13.56,57.84
  Bottom 0.152: J24.F15 32.15,92.68 16.27,92.68 6.84,83.25 6.84,73.16 13.56,66.44 v13.56,57.84
DIO16  (via drill 0.35)
  Top 0.152: RN10.6 70.2,56.01 v70.18,56.04
  Bottom 0.152: J24.C39 63.62,97.39 64.22,96.78 67.74,96.78 68.95,95.58 68.95,90.98 62.25,84.28 62.25,75.5 70.18,67.57 v70.18,56.04
DIO17  (via drill 0.35)
  Top 0.152: RN10.7 69.41,56.52 v69.38,56.55
  Bottom 0.152: J24.C38 62.33,97.39 62.9,96.81 63.65,96.81 64.19,96.28 64.19,95.86 64.52,95.53 64.94,95.53 65.48,94.99 65.48,89.1 61,84.61 61,75.5 69.38,67.12 v69.38,56.55
DIO21  (via drill 0.3)
  Top 0.152: v55.3,98 55.9,98.6 55.9,101.8 58.29,104.19 74.39,104.19 74.8,104.6 119.9,104.6 136.65,121.35 136.66,121.35 J29.15
  Bottom 0.152: J24.C32 55.25,98 v55.3,98
DIO22  (via drill 0.3)
  Top 0.152: v52.7,98 53.3,98.6 53.3,103.4 56.3,106.4 71.8,106.4 74.1,108.7 114.1,108.7 126.69,121.29 J29.7
  Bottom 0.152: J24.C30 v52.7,97.99 v52.7,98
DIO23  (via drill 0.3)
  Top 0.152: v51.5,98 52.1,98.6 52.1,104 55.8,107.7 71,107.7 73.5,110.2 110.3,110.2 121.61,121.51 J29.3
  Bottom 0.152: J24.C29 51.44,98 v51.5,98
DIO24  (via drill 0.3)
  Top 0.152: v48.9,98 49.5,98.6 49.5,105 54.8,110.3 68.4,110.3 71.9,113.8 95.4,113.8 103.1,121.5 J28.15
  Bottom 0.152: J24.C27 v48.9,98 | v48.9,98
DIO25  (via drill 0.3)
  Top 0.152: v47.7,98 48.3,98.6 48.3,105.6 54.2,111.5 66.7,111.5 71.2,116 92.5,116 98.02,121.52 J28.11
  Bottom 0.152: J24.C26 47.09,97.39 v47.7,98
DIO26  (via drill 0.3)
  Top 0.152: v45.1,98 45.72,98.62 45.72,106.72 52.9,113.9 64.4,113.9 70.3,119.8 86.2,119.8 87.86,121.46 J28.3
  Bottom 0.152: J24.C24 v45.1,98
DIO27  (via drill 0.3)
  Top 0.152: v43.8,98 44.5,98.7 44.5,107.3 52.3,115.1 61.9,115.1 68.31,121.5 J27.19
  Bottom 0.152: J24.C23 43.8,97.98 v43.8,98
DIO28  (via drill 0.3)
  Top 0.152: v41.3,98 41.9,98.6 41.9,108.6 50.8,117.5 54.3,117.5 58.15,121.34 J27.11
  Bottom 0.152: J24.C21 41.28,98 v41.3,98
DIO29  (via drill 0.3)
  Top 0.152: v39.95,98.05 40.7,98.79 40.7,110 49.4,118.7 50.8,118.7 53.06,120.97 J27.7
  Bottom 0.152: J24.C20 39.95,97.94 v39.95,98.05
DIO30  (via drill 0.3)
  Top 0.152: v36.2,96.7 36.9,97.4 36.9,109.8 29.5,117.2 29.5,121.52 J26.15
  Bottom 0.152: J24.C18 36.85,97.36 v36.2,96.7
DIO31  (via drill 0.3)
  Top 0.152: v36.2,98 35.5,98.7 35.5,106.4 24.4,117.5 24.4,119.5 | 24.4,119.5 24.4,119.6 | 24.4,119.5 24.39,119.5 J26.11
  Bottom 0.152: J24.C17 v36.2,98 | v36.2,98
DIO32  (via drill 0.35)
  Top 0.152: v61.62,94.18 61.62,89.1 57.26,84.73 RN4.5
  Bottom 0.152: J24.E37 61.62,94.2 v61.62,94.18
DIO33  (via drill 0.3)
  Top 0.152: v60.35,94.19 60.35,89.4 56.45,85.5 RN4.6
  Bottom 0.152: J24.E36 60.35,94.21 v60.35,94.19
DIO34  (via drill 0.3)
  Top 0.152: v57.78,94.19 57.78,88.43 55.63,86.28 55.63,83.08 RN4.7
  Bottom 0.152: J24.E34 57.78,94.24 v57.78,94.19
DIO35  (via drill 0.3)
  Top 0.152: v56.5,94.25 56.5,89 54.85,87.35 RN4.8
  Bottom 0.152: J24.E33 v56.5,94.25 | v56.5,94.25
DIO36  (via drill 0.3)
  Top 0.152: v54,94.24 54,91.67 45.5,83.17 43.59,83.17 RN3.5
  Bottom 0.152: J24.E31 53.97,94.24 v54,94.24
DIO37  (via drill 0.3)
  Top 0.152: v52.7,94.19 52.7,91.75 45.68,84.72 43.36,84.72 42.67,84.03 RN3.6
  Bottom 0.152: J24.E30 52.7,94.23 v52.7,94.19
DIO38  (via drill 0.3)
  Top 0.152: v50.19,94.23 50.19,90.56 45.11,85.47 42.86,85.47 41.89,84.5 RN3.7
  Bottom 0.152: J24.E28 50.17,94.23 v50.19,94.23
DIO39  (via drill 0.3)
  Top 0.152: v48.9,94.22 48.9,90.59 44.53,86.22 42.44,86.22 41.1,84.89 41.1,83.09 RN3.8
  Bottom 0.152: J24.E27 v48.9,94.23 v48.9,94.22
DIO40  (via drill 0.3)
  Top 0.152: v46.36,94.25 46.36,90.36 43.01,87.01 41.41,87.01 38.28,83.89 30.54,83.89 RN2.5
  Bottom 0.152: J24.E25 46.34,94.25 v46.36,94.25
DIO41  (via drill 0.3)
  Top 0.152: v45.11,94.22 45.11,91.92 37.79,84.6 29.51,84.6 28.93,84.02 RN2.6
  Bottom 0.152: J24.E24 45.09,94.22 v45.11,94.22
DIO42  (via drill 0.3)
  Top 0.152: v42.51,94.25 42.51,90.53 37.3,85.33 29.25,85.33 28.12,84.2 RN2.7
  Bottom 0.152: J24.E22 42.51,94.28 v42.51,94.25
DIO43  (via drill 0.3)
  Top 0.152: v41.28,94.22 41.28,90.31 37.16,86.19 28.84,86.19 27.34,84.69 27.34,83.08 RN2.8
  Bottom 0.152: J24.E21 v41.28,94.23 v41.28,94.22
DIO44  (via drill 0.3)
  Top 0.152: v38.74,94.22 38.74,89.52 36.81,87.58 19.66,87.58 15.96,83.89 RN1.5
  Bottom 0.152: J24.E19 v38.74,94.22
DIO45  (via drill 0.3)
  Top 0.152: v37.47,94.2 37.47,89.81 36.09,88.44 19.33,88.44 15.16,84.27 RN1.6
  Bottom 0.152: J24.E18 37.47,94.23 v37.47,94.2
DIO46  (via drill 0.3)
  Top 0.152: v34.93,94.22 34.93,90.87 33.63,89.57 19.32,89.57 14.37,84.61 RN1.7
  Bottom 0.152: J24.E16 v34.93,94.23 v34.93,94.22
DIO47  (via drill 0.3)
  Top 0.152: v33.66,94.22 33.66,91.42 32.88,90.64 18.86,90.64 13.59,85.36 13.59,83.09 RN1.8
  Bottom 0.152: J24.E15 v33.66,94.23 v33.66,94.22
DIO48  (via drill 0.35)
  Top 0.152: RN10.5 v71,56.5
  Bottom 0.152: J24.B39 64.08,98.1 67.48,98.1 69.69,95.89 69.69,90.19 63.5,84 63.5,75.5 71,68 v71,56.5
DIO49  (via drill 0.35)
  Top 0.152: RN10.8 v68.61,56.05 v68.6,56.05
  Bottom 0.152: J24.B37 61.6,98.03 61.6,97.17 62.08,96.7 62.45,96.7 62.89,96.26 62.89,88.14 59.75,85 59.75,75.5 68.6,66.65 v68.6,56.05
DIO52  (via drill 0.3)
  Top 0.152: v56.5,99.3 56.5,101.37 58.71,103.58 121.48,103.58 139.19,121.29 139.19,121.34 J29.17
  Bottom 0.152: J24.B33 56.5,99.25 v56.5,99.3
DIO53  (via drill 0.3)
  Top 0.152: v54,99.3 54.6,99.9 54.6,102.7 57.2,105.3 73.2,105.3 74.5,106.6 116.9,106.6 131.77,121.47 J29.11
  Bottom 0.152: J24.B31 v54,99.29 v54,99.3
DIO54  (via drill 0.3)
  Top 0.152: v52.7,99.3 52.7,103.7 56,107 71.5,107 73.9,109.4 112.2,109.4 124.15,121.35 J29.5
  Bottom 0.152: J24.B30 52.7,99.26 v52.7,99.3
DIO55  (via drill 0.3)
  Top 0.152: v50.2,99.3 50.8,99.9 50.8,104.6 55.3,109.1 69.8,109.1 72.7,112 98.6,112 108.14,121.54 J28.19
  Bottom 0.152: J24.B28 | J24.B28 v50.2,99.3
DIO56  (via drill 0.3)
  Top 0.152: v48.9,99.3 48.9,105.3 54.5,110.9 67.5,110.9 71.6,115 94,115 100.54,121.54 J28.13
  Bottom 0.152: J24.B27 48.9,99.27 v48.9,99.3
DIO57  (via drill 0.3)
  Top 0.152: v46.4,99.3 47,99.9 47,106.2 53.5,112.7 65.7,112.7 70.8,117.8 89.2,117.8 J28.7 | J28.7
  Bottom 0.152: J24.B25 v46.39,99.3 v46.4,99.3
DIO58  (via drill 0.3)
  Top 0.152: v45.1,99.3 45.1,107 52.6,114.5 63.5,114.5 70.5,121.5 85.28,121.5 J28.1
  Bottom 0.152: J24.B24 44.48,98.67 v45.1,99.3
DIO59  (via drill 0.3)
  Top 0.152: v42.6,99.3 43.2,99.9 43.2,107.8 51.7,116.3 58.1,116.3 63.23,121.42 J27.15
  Bottom 0.152: J24.B22 42.58,99.3 v42.6,99.3
DIO60  (via drill 0.3)
  Top 0.152: v41.3,99.3 41.3,109.1 50.3,118.1 52.5,118.1 54.85,120.45 54.9,120.5 55.6,121.2 J27.9
  Bottom 0.152: J24.B21 v41.3,99.29 v41.3,99.3
DIO61  (via drill 0.3)
  Top 0.152: v38.7,99.3 39.3,99.9 39.3,112.5 47.98,121.19 J27.3
  Bottom 0.152: J24.B19 38.7,99.23 v38.7,99.3
DIO62  (via drill 0.3)
  Top 0.152: v37.5,99.3 37.5,111.3 32,116.8 32,121.53 J26.17
  Bottom 0.152: J24.B18 v37.5,99.3 | v37.5,99.3
DIO77  (via drill 0.3)
  Top 0.152: v38.8,96.8 38.1,97.5 38.1,112.9 34.6,116.4 34.6,121.5 J26.19
  Bottom 0.152: J24.D19 38.12,96.12 v38.8,96.8
DIO78  (via drill 0.3)
  Top 0.152: v34.9,96.7 34.9,104.8 21.8,117.9 21.8,121.48 J26.9
  Bottom 0.152: J24.D17 35,96.7 v34.9,96.7
DIO79  (via drill 0.3)
  Top 0.152: v33.7,95.5 34.3,96.1 34.3,103.6 19.3,118.6 19.3,121.53 J26.7
  Bottom 0.152: J24.D16 v33.7,95.5 | v33.7,95.5
DIO80  (via drill 0.3)
  Top 0.152: v69.41,84.82 RN5.7
  Bottom 0.152: J24.A40 68.08,99.92 71.72,96.28 71.72,89.32 69.42,87.01 v69.42,84.83 v69.41,84.82
DIO81  (via drill 0.3)
  Top 0.152: v70.21,84.33 RN5.6
  Bottom 0.152: J24.A38 62.98,100.65 68.31,100.65 72.54,96.42 72.54,88.94 70.33,86.72 70.33,84.45 v70.21,84.33
DIO82  (via drill 0.3)
  Top 0.152: v71.06,84.81 71.06,83.12 RN5.5
  Bottom 0.152: J24.A37 61.48,100.42 61.66,100.42 62.46,101.22 68.61,101.22 73.39,96.45 73.39,88.56 71.08,86.26 71.08,84.84 v71.06,84.81
DIO83  (via drill 0.3)
  Top 0.152: v68.57,84.37 68.57,83.11 RN5.8
  Bottom 0.152: J24.A35 59.09,100.57 60.01,100.57 60.38,100.19 60.38,99.68 60.85,99.2 63.74,99.2 63.92,99.03 64.39,99.03 64.68,99.31 67.71,99.31 70.98,96.05 70.98,89.75 68.61,87.38 68.61,84.41 v68.57,84.37
DIO85  (via drill 0.3)
  Top 0.152: v55.23,100.47 55.23,102.23 57.8,104.8 73.8,104.8 74.6,105.6 118.5,105.6 134.31,121.41 J29.13
  Bottom 0.152: J24.A32 55.18,100.47 v55.23,100.47
DIO86  (via drill 0.3)
  Top 0.152: v54,100.5 54,103.1 56.8,105.9 72.3,105.9 74.1,107.7 115.4,107.7 128.93,121.23 128.93,121.24 J29.9
  Bottom 0.152: J24.A31 53.42,99.92 v54,100.5
DIO87  (via drill 0.3)
  Top 0.152: v51.4,100.5 51.4,104.2 55.6,108.4 70.4,108.4 73,111 108.5,111 119.04,121.54 J29.1
  Bottom 0.152: J24.A29 v51.4,100.5 | v51.4,100.5
DIO88  (via drill 0.3)
  Top 0.152: v50.2,100.5 50.2,104.8 55.1,109.7 69,109.7 72.2,112.9 97,112.9 J28.17 | J28.17
  Bottom 0.152: J24.A28 50.13,100.5 v50.2,100.5
DIO89  (via drill 0.3)
  Top 0.152: v47.65,100.45 47.65,105.95 53.8,112.1 66.1,112.1 71,117 91,117 95.48,121.48 J28.9
  Bottom 0.152: J24.A26 47.54,100.45 v47.65,100.45
DIO90  (via drill 0.3)
  Top 0.152: v46.3,100.5 46.3,106.4 53.2,113.3 65.1,113.3 70.5,118.7 87.6,118.7 90.4,121.5 J28.5
  Bottom 0.152: J24.A25 45.74,99.94 v46.3,100.5
DIO91  (via drill 0.3)
  Top 0.152: v43.8,100.5 43.8,107.5 52,115.7 60.1,115.7 65.77,121.36 J27.17
  Bottom 0.152: J24.A23 43.78,100.5 v43.8,100.5
DIO92  (via drill 0.3)
  Top 0.152: v42.5,100.54 42.5,108.1 51.3,116.9 56.3,116.9 60.69,121.28 J27.13
  Bottom 0.152: J24.A22 42.5,100.49 v42.5,100.54
DIO93  (via drill 0.3)
  Top 0.152: v40,100.5 40,110.8 50.52,121.33 J27.5
  Bottom 0.152: J24.A20 39.97,100.5 v40,100.5
DIO94  (via drill 0.3)
  Top 0.152: v38.7,100.54 38.7,114.7 45.45,121.44 J27.1
  Bottom 0.152: J24.A19 38.12,99.97 v38.7,100.54
DIO95  (via drill 0.3)
  Top 0.152: v36.2,100.5 36.2,108 26.9,117.3 26.9,121.5 J26.13
  Bottom 0.152: J24.A17 35.62,99.92 v36.2,100.5
DONE#_DIO2[1]
  Bottom 0.152: J24.B9 26.05,99.28 26.05,101.22 25.49,101.79 25.49,104.2 29.54,108.25 101.5,108.25 124.41,85.34 133.91,85.34 138.5,80.75 138.5,78.88 J1.15
ESTP+  (via drill 0.35)
  Top 0.152: J9.5 10.78,36.98 v10.75,37 | J4.5 10.78,64.63 10.05,65.36 7.99,65.36 v7.96,65.39 | v24.5,37 24.52,36.98 J10.5 | v38.25,37 v38.26,36.99 J11.5 38.28,35.53 38.28,35.52 | v52,37 J12.5 | v65.75,37 65.75,35.58 J13.5 65.73,33.77 71.84,27.66 J25.2
  Top 0.2: J8.5 65.73,64.56 64.97,65.33 61.2,65.33 59.67,63.8 59.67,61.16 58.05,59.53 54.13,59.53 51.99,61.67 J7.5 51.99,64.68 51.25,65.42 47.38,65.42 45.49,63.53 45.49,60.53 44.59,59.62 40.42,59.62 38.26,61.79 J6.5 38.2,63.55 38.18,63.52 38.18,64.59 37.41,65.36 32.98,65.36 | 30.7,59.56 30.59,59.56 26.68,59.56 24.52,61.73 24.52,63 | 24.52,63 J5.5 | 24.52,63 24.57,63.05 24.57,64.69 23.8,65.45 19.78,65.45 17.75,63.42 17.75,60.48 16.92,59.66 12.96,59.66 10.78,61.84 J4.5 | 38.28,35.52 38.26,35.5
  Top 0.203: 30.57,59.56 30.59,59.56 | 30.7,59.56 31.59,60.46 31.59,63.98 32.98,65.36
  Bottom 0.152: v7.96,65.39 7.96,64.82 6.75,63.62 6.75,38.75 7.83,37.67 10.08,37.67 v10.75,37 11.48,37.73 23.79,37.73 24.5,37.02 v24.5,37 25.22,37.72 37.53,37.72 v38.25,37 39,37.75 51.25,37.75 v52,37 52.75,37.75 65,37.75 v65.75,37
ESTP-  (via drill 0.35)
  Top 0.152: J9.6 9.78,36.95 v9.75,36.98 | J4.6 9.78,64.55 9.64,64.68 7.32,64.68 v6.87,65.14 | v23.5,37 23.52,36.98 J10.6 | v37.25,37 v37.26,36.99 J11.6 | v51,37 J12.6 | v64.75,37 64.75,35.58 J13.6 64.73,31.77 70.59,25.91 J25.1
  Top 0.2: J8.6 64.73,64.39 64.31,64.83 61.42,64.83 60.15,63.55 60.15,60.91 58.32,59.09 53.77,59.09 50.99,61.87 J7.6 50.99,64.51 50.59,64.92 47.85,64.92 46.12,63.18 46.12,60.44 44.85,59.17 40.06,59.17 37.26,61.98 J6.6 37.2,63.55 37.17,63.52 37.17,64.42 36.74,64.86 33.6,64.86 | 30.86,59.12 26.32,59.12 23.52,61.92 J5.6 23.57,63.55 23.57,64.52 23.14,64.94 20,64.94 18.23,63.17 18.23,60.06 17.37,59.2 12.61,59.2 9.78,62.03 J4.6
  Top 0.203: 30.86,59.12 31.16,59.12 32.38,60.33 32.38,63.62 33.6,64.86
  Bottom 0.152: v6.87,65.14 6.09,64.36 6.09,38.66 7.77,36.98 v9.75,36.98 10.48,36.25 11.25,36.25 12,37 v23.5,37 24.25,36.25 25,36.25 25.75,37 v37.25,37 38,36.25 39,36.25 39.75,37 v51,37 51.75,36.25 52.75,36.25 53.5,37 v64.75,37
GND  (via drill 0.3, 0.35, 0.5, 3.3 pad 5.5)
  Top 0.305: J14.1 7.79,66.94 v7.75,66.9 | J15.1 21.53,66.98 v21.45,66.9 | J16.1 35.27,66.92 v35.25,66.9 | J17.1 49.01,67.06 v48.95,67 | J18.1 62.75,67 v62.65,66.9 | J23.1 62.75,39.1 v62.65,39 | J22.1 49.01,39.16 v48.95,39.1 | J21.1 35.27,39.22 v35.15,39.1 | J20.1 21.53,39.28 v21.45,39.2 | J19.1 7.79,39.06 v7.73,39 | U6.8 9.36,46.7 v10.46,46.7 | U7.8 23.08,46.73 v24.23,46.73 | v65.49,46.76 64.28,46.76 U10.8 | U9.8 v51.74,46.76 v51.75,46.75 | U8.8 v37.99,46.76 v38,46.75 | C6.2 72.27,75.92 v72,75.92 | C7.2 59.15,76.65 v58.75,76.25 | C8.2 45.38,76.38 v45,76 | C9.2 31.57,76.33 v31.25,76 | C10.2 17.77,76.52 v17.5,76.25 | C4.2 31.58,48.08 v31.28,47.78 | C5.2 17.96,48.21 v17.5,47.75 | C3.2 45.41,48.16 v45,47.75 | C2.2 59.19,48.19 v58.75,47.75 | C1.2 73.75,48.3 v73.75,48.25 | U1.8 10.53,74.69 v10.58,74.64 | U2.8 v24.32,74.69 v24.33,74.69 | U3.8 37.98,74.69 v38.08,74.59 | U4.8 51.77,74.69 v51.85,74.61 | U5.8 65.42,74.69 v65.52,74.6
  Bottom 0.152: J24.E17 v36.2,94.23 | v36.2,94.23 | J24.E20 40.02,94.22 v40.02,94.2 | J24.E23 v43.84,94.2 v43.85,94.2 | J24.E26 47.62,94.23 v47.66,94.23 | J24.E29 51.47,94.2 v51.47,94.19 | J24.E32 v55.26,94.22 | J24.E35 v59.08,94.21 v59.08,94.2 | J24.F34 57.17,92.75 v57.13,92.72 | J24.F37 60.98,92.77 v61,92.75 | J24.E38 v61.65,95.45 v61.64,95.45 | J24.D39 63.52,95.66 64.15,95.03 v64.15,94.2 | J24.C40 64.81,97.37 v65.77,97.37 | J24.C37 v60.35,96.75 J24.D36 | J24.D33 v56.54,96.75 | v56.54,96.75 | J24.C34 v56.54,96.75 | v56.54,96.75 | J24.C31 v52.73,96.75 | v52.73,96.75 | J24.D30 v52.73,96.75 | J24.C28 v48.94,96.77 v48.93,96.77 48.28,96.12 J24.D27 | J24.C25 45.15,96.78 v45.11,96.78 44.48,96.15 J24.D24 | J24.C22 v41.32,96.77 | v41.32,96.77 | J24.D21 | J24.D21 v41.32,96.77 | J24.C19 v37.51,96.77 v37.5,96.77 J24.D18 | J24.D15 v33.67,96.74 J24.C16 | J24.A39 63.79,99.92 v63.99,99.72 v64,99.72 | J24.B38 v62.85,98.06 v62.85,98.05 | J24.B35 v59.08,99.29 | v59.08,99.29 v59.08,99.3 | J24.A36 v59.08,99.29 | J24.A33 55.29,99.31 | 55.29,99.31 v55.26,99.31 | J24.B32 55.29,99.31 | J24.A30 51.47,99.3 v51.45,99.3 J24.B29 | J24.B26 v47.65,99.28 | v47.65,99.28 | J24.A27 v47.65,99.28 | v47.65,99.28 | J24.A24 v43.84,99.3 v43.84,99.29 J24.B23 | J24.A21 v40.02,99.28 | v40.02,99.28 | J24.B20 v40.02,99.28 | J24.B17 35.63,98.66 v36.24,99.26 36.85,99.88 J24.A18 | J24.A12 29.23,100.78 v29.2,100.81 | J24.A15 33.05,100.86 v33.03,100.87 | J24.A9 25.43,100.93 v25.37,100.98 | J24.F31 53.37,92.7 v53.35,92.69 | J24.F28 49.55,92.67 v49.54,92.66 | J24.F16 34.31,92.72 v34.3,92.71 | J24.F19 v38.12,92.72 v38.13,92.71 | J24.F22 41.94,92.64 v41.92,92.63 | J24.F25 v45.74,92.64 | v45.74,92.64 | J24.E14 v31.13,94.2
  Bottom 0.152: v31.13,94.2 | J24.F13 | J24.F13 v31.13,94.2 | J24.E11 v28.6,95.47 J24.D12 | J24.D9 25.43,96.06 v24.83,95.47 24.77,95.47 J24.E8 | J24.F6 v22.25,94.19 J24.E7 | J24.F5 v19.72,94.2 v19.71,94.2 J24.E4 | J24.F2 v17.19,94.22 J24.E3 | J24.F1 14.71,94.12 14.71,94.18 v14.63,94.18 | J24.D5 19.75,96.71 v19.75,96.75 19.11,97.39 J24.C4 | J24.D2 16.56,96.11 v17.18,96.73 17.8,97.36 J24.C3 | J24.D1 15.19,96.11 v14.6,95.52 v14.59,95.52 | J24.B1 v14.65,98.05 | v14.65,98.05 | J24.B2 v17.16,99.28 | v17.16,99.28 | J24.A3 v17.16,99.28 | v17.16,99.28 | J24.A4 v19.68,99.32 | v19.68,99.32 | J24.B5 | J24.B5 v19.68,99.32 | J24.C7 23.52,96.75 v23.52,95.47 | v27.15,96.92 26.7,97.37 J24.C10 | J24.B11 28.41,98.21 v28.41,98.19 | v31.09,96.8 J24.C13 J24.B14 | J24.B8 v24.16,99.1 | v24.16,99.1